# EAGLE design Multiprotocol_STM32_MB_1.1_t (EAGLE 9.5.1)

## Sheet 1 of 4
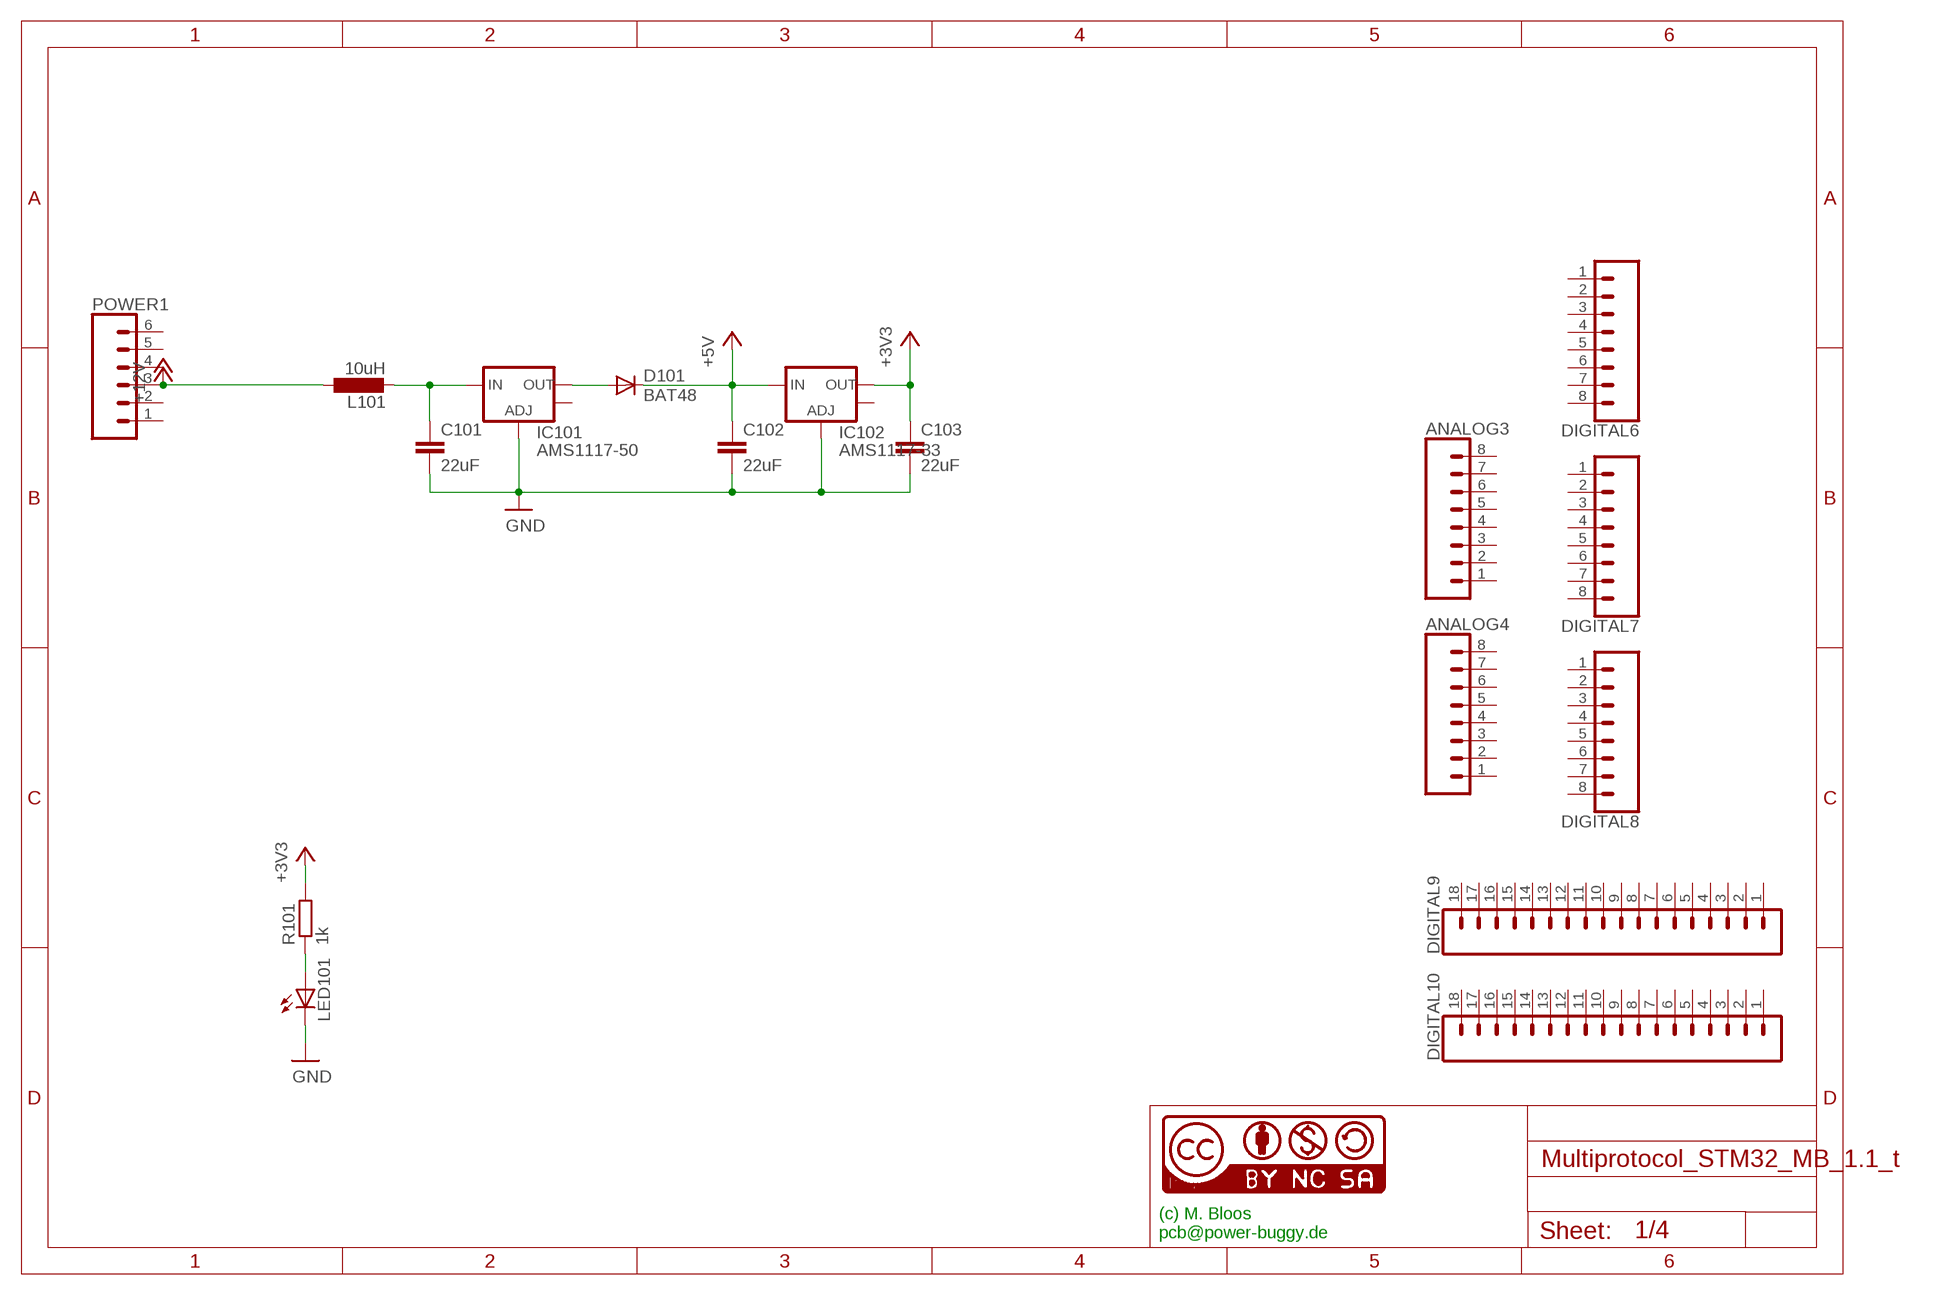
[diagram p0: schematic, sheet 1]

### Parts
ANALOG3  CONN_08NO_SILK_FEMALE_PTH  [1X08_NO_SILK]
ANALOG4  CONN_08NO_SILK_FEMALE_PTH  [1X08_NO_SILK]
C101  22uF  C-EUC1210K  [C1210K]
C102  22uF  C-EUC1210K  [C1210K]
C103  22uF  C-EUC1210K  [C1210K]
D101  BAT48  DIODE-MINIMELF  [MINIMELF]
DIGITAL6  CONN_08NO_SILK_FEMALE_PTH  [1X08_NO_SILK]
DIGITAL7  CONN_08NO_SILK_FEMALE_PTH  [1X08_NO_SILK]
DIGITAL8  CONN_08NO_SILK_FEMALE_PTH  [1X08_NO_SILK]
DIGITAL9  CONN_18  [1X18]
DIGITAL10  CONN_18  [1X18]
IC101  AMS1117-50  V_REG_LM1117SOT223  [SOT223]
IC102  AMS1117-33  V_REG_LM1117SOT223  [SOT223]
L101  10uH  L-EUL1812  [L1812]
LED101  LED3MM  [LED3MM]
NIX101  CC-NC-BCNIX  [CC-NC-B_NIX]
POWER1  CONN_06NO_SILK_FEMALE_PTH  [1X06_NO_SILK]
R101  1k  R-EU_R0805  [R0805]

### Nets
+3V3: C103.1 IC102.2(OUT) R101.2 ; also sheet 2,3,4
+5V: C102.1 D101.C IC102.3(IN) ; also sheet 2
+12V: L101.1 POWER1.3 ; also sheet 3
GND: C101.2 C102.2 C103.2 IC101.1(ADJ) IC102.1(ADJ) LED101.K(C) ; also sheet 2,3,4
N$4: C101.1 IC101.3(IN) L101.2
N$6: LED101.A R101.1
N$19: D101.A IC101.2(OUT)
Unconnected: ANALOG3.1 ANALOG3.2 ANALOG3.3 ANALOG3.4 ANALOG3.5 ANALOG3.6 ANALOG3.7 ANALOG3.8 ANALOG4.1 ANALOG4.2 ANALOG4.3 ANALOG4.4 ANALOG4.5 ANALOG4.6 ANALOG4.7 ANALOG4.8 DIGITAL6.1 DIGITAL6.2 DIGITAL6.3 DIGITAL6.4 DIGITAL6.5 DIGITAL6.6 DIGITAL6.7 DIGITAL6.8 DIGITAL7.1 DIGITAL7.2 DIGITAL7.3 DIGITAL7.4 DIGITAL7.5 DIGITAL7.6 DIGITAL7.7 DIGITAL7.8 DIGITAL8.1 DIGITAL8.2 DIGITAL8.3 DIGITAL8.4 DIGITAL8.5 DIGITAL8.6 DIGITAL8.7 DIGITAL8.8 DIGITAL9.1 DIGITAL9.2 DIGITAL9.3 DIGITAL9.4 DIGITAL9.5 DIGITAL9.6 DIGITAL9.7 DIGITAL9.8 DIGITAL9.9 DIGITAL9.10 DIGITAL9.11 DIGITAL9.12 DIGITAL9.13 DIGITAL9.14 DIGITAL9.15 DIGITAL9.16 DIGITAL9.17 DIGITAL9.18 DIGITAL10.1 DIGITAL10.2 DIGITAL10.3 DIGITAL10.4 DIGITAL10.5 DIGITAL10.6 DIGITAL10.7 DIGITAL10.8 DIGITAL10.9 DIGITAL10.10 DIGITAL10.11 DIGITAL10.12 DIGITAL10.13 DIGITAL10.14 DIGITAL10.15 DIGITAL10.16 DIGITAL10.17 DIGITAL10.18 IC101.4(OUT) IC102.4(OUT) POWER1.1 POWER1.2 POWER1.4 POWER1.5 POWER1.6

### Notes on the sheet
- (c) M. Bloos 
  pcb@power-buggy.de

## Sheet 2 of 4
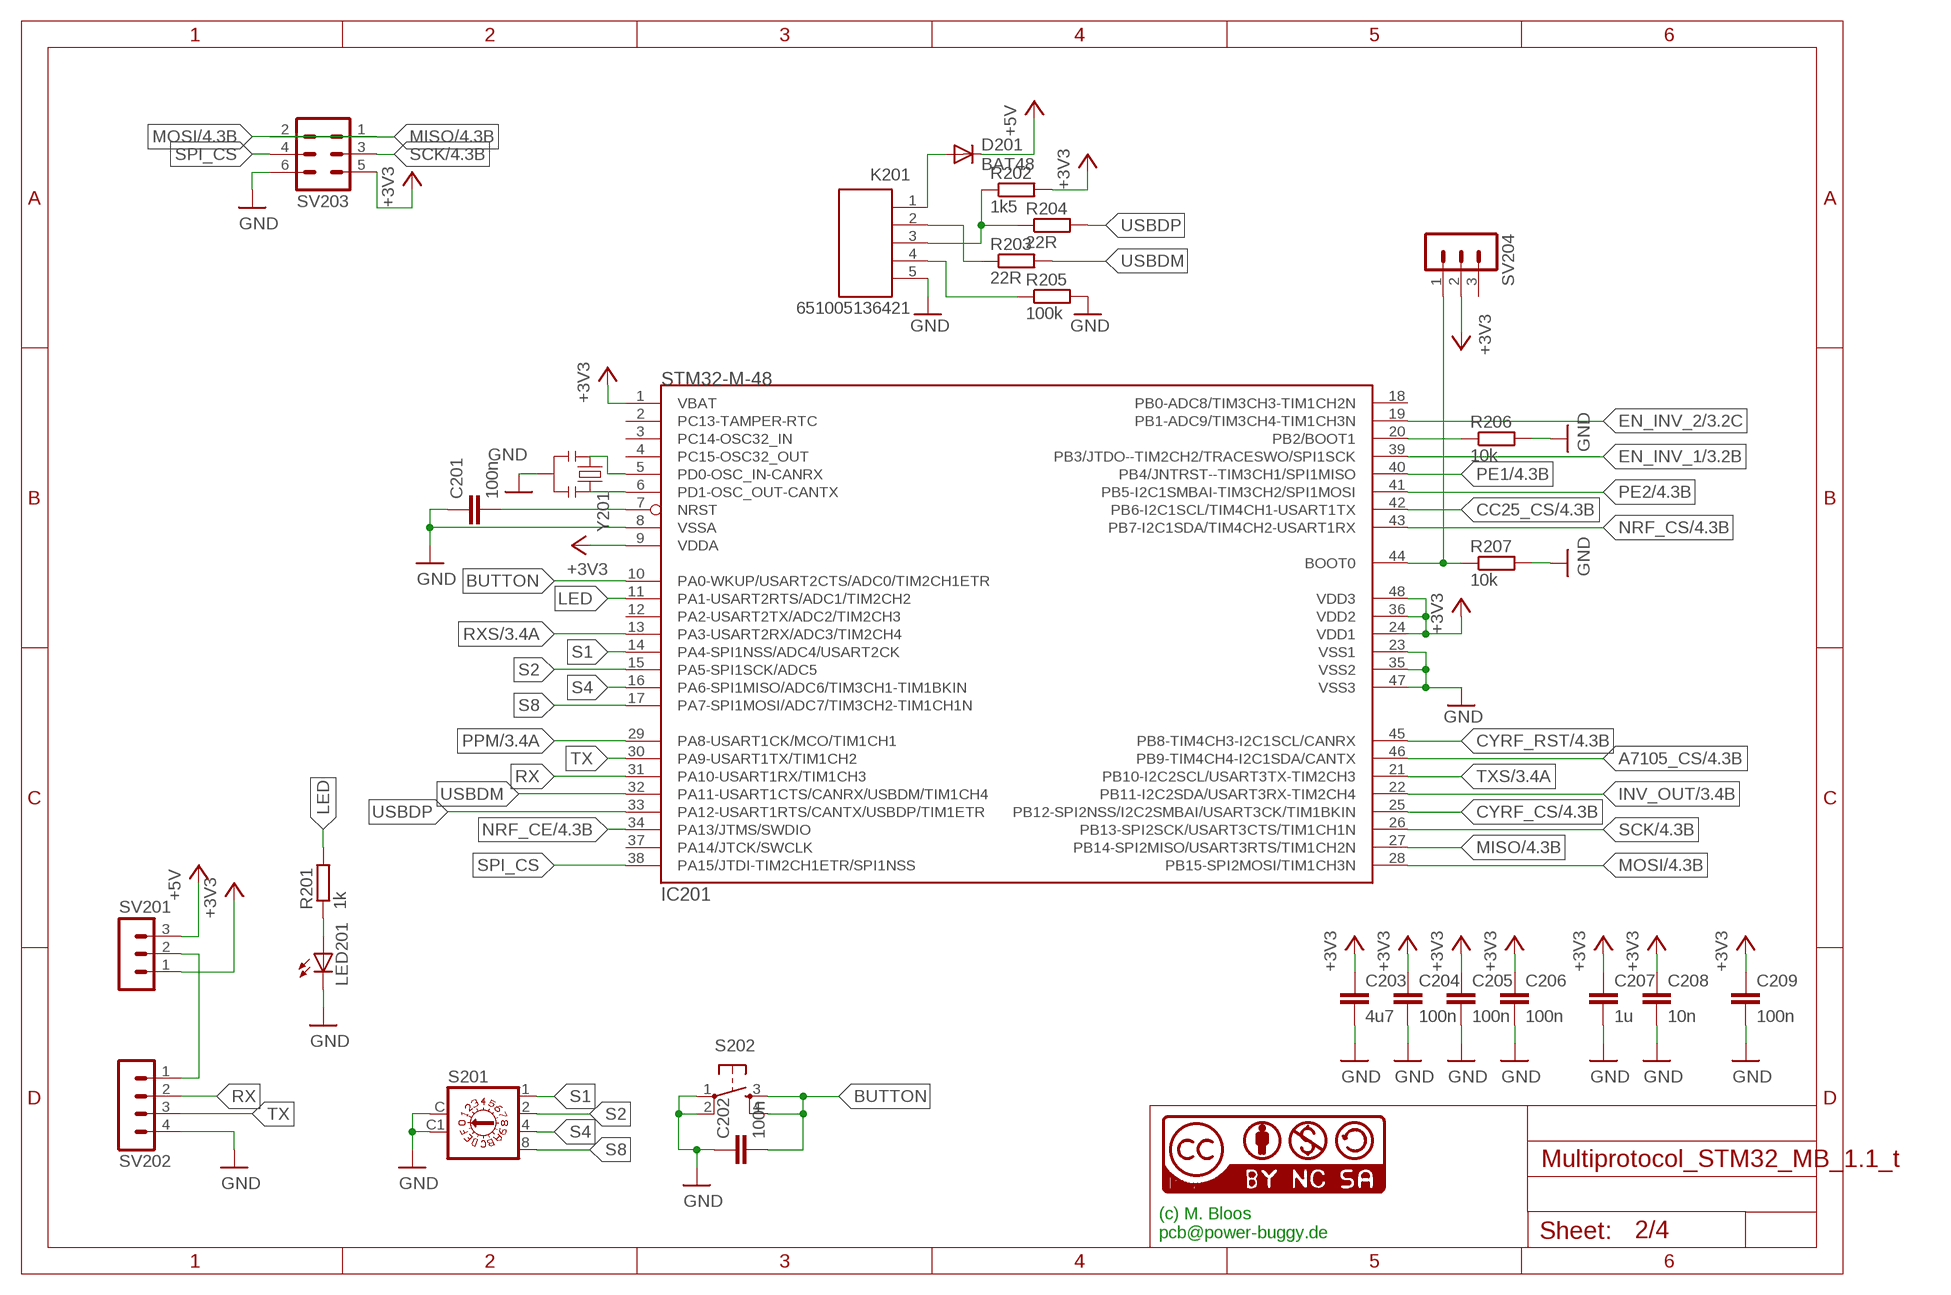
[diagram p1: schematic, sheet 2]

### Parts
C201  100n  C-EUC0805  [C0805]
C202  100n  C-EUC0805  [C0805]
C203  4u7  C-EUC0805  [C0805]
C204  100n  C-EUC0805  [C0805]
C205  100n  C-EUC0805  [C0805]
C206  100n  C-EUC0805  [C0805]
C207  1u  C-EUC0805  [C0805]
C208  10n  C-EUC0805  [C0805]
C209  100n  C-EUC0805  [C0805]
D201  BAT48  DIODE-MINIMELF  [MINIMELF]
IC201  STM32-M-48  [LQFP48]
K201  651005136421  [651005136421]
LED201  LED3MM  [LED3MM]
NIX201  CC-NC-BCNIX  [CC-NC-B_NIX]
R201  1k  R-EU_R0805  [R0805]
R202  1k5  R-EU_R0805  [R0805]
R203  22R  R-EU_R0805  [R0805]
R204  22R  R-EU_R0805  [R0805]
R205  100k  R-EU_R0805  [R0805]
R206  10k  R-EU_R0805  [R0805]
R207  10k  R-EU_R0805  [R0805]
S201  A1353HEX  [A1353HEX]
S202  TAC_SWITCHPTH  [TACTILE-PTH]
SV201  MA03-1  [MA03-1]
SV202  MA04-1  [MA04-1]
SV203  MA03-2  [MA03-2]
SV204  MA03-1  [MA03-1]
Y201  CSTCE8M00G52-R0  RESONATORSMD  [RESONATOR-SMD]

### Nets
+3V3: C203.1 C204.1 C205.1 C206.1 C207.1 C208.1 C209.1 IC201.1(VBAT) IC201.9(VDDA) IC201.24(VDD1) IC201.36(VDD2) IC201.48(VDD3) R202.2 SV201.1 SV203.5 SV204.2 ; also sheet 1,3,4
+5V: D201.C SV201.3 ; also sheet 1
A7105_CS: IC201.46(PB9-TIM4CH4-I2C1SDA/CANTX) ; also sheet 4
BUTTON: C202.2 IC201.10(PA0-WKUP/USART2CTS/ADC0/TIM2CH1ETR) S202.3 S202.4
CC25_CS: IC201.42(PB6-I2C1SCL/TIM4CH1-USART1TX) ; also sheet 4
CYRF_CS: IC201.25(PB12-SPI2NSS/I2C2SMBAI/USART3CK/TIM1BKIN) ; also sheet 4
CYRF_RST: IC201.45(PB8-TIM4CH3-I2C1SCL/CANRX) ; also sheet 4
EN_INV_1: IC201.39(PB3/JTDO--TIM2CH2/TRACESWO/SPI1SCK) ; also sheet 3
EN_INV_2: IC201.19(PB1-ADC9/TIM3CH4-TIM1CH3N) ; also sheet 3
GND: C201.1 C202.1 C203.2 C204.2 C205.2 C206.2 C207.2 C208.2 C209.2 IC201.8(VSSA) IC201.23(VSS1) IC201.35(VSS2) IC201.47(VSS3) K201.5 LED201.K(C) R205.2 R206.2 R207.2 S201.C S201.C1(NC) S202.1 S202.2 SV202.4 SV203.6 Y201.2 ; also sheet 1,3,4
INV_OUT: IC201.22(PB11-I2C2SDA/USART3RX-TIM2CH4) ; also sheet 3
LED: IC201.11(PA1-USART2RTS/ADC1/TIM2CH2) R201.2
MISO: IC201.27(PB14-SPI2MISO/USART3RTS/TIM1CH2N) SV203.2 ; also sheet 4
MOSI: IC201.28(PB15-SPI2MOSI/TIM1CH3N) SV203.1 ; also sheet 4
N$2: IC201.5(PD0-OSC_IN-CANRX) Y201.1
N$3: IC201.6(PD1-OSC_OUT-CANTX) Y201.3
N$7: SV201.2 SV202.1
N$9: K201.4 R205.1
N$11: LED201.A R201.1
N$12: C201.2 IC201.7(NRST)
N$13: K201.3 R202.1 R204.1
N$14: D201.A K201.1
N$17: K201.2 R203.1
N$23: IC201.44(BOOT0) R207.1 SV204.1
N$26: IC201.20(PB2/BOOT1) R206.1
NRF_CE: IC201.34(PA13/JTMS/SWDIO) ; also sheet 4
NRF_CS: IC201.43(PB7-I2C1SDA/TIM4CH2-USART1RX) ; also sheet 4
PE1: IC201.40(PB4/JNTRST--TIM3CH1/SPI1MISO) ; also sheet 4
PE2: IC201.41(PB5-I2C1SMBAI-TIM3CH2/SPI1MOSI) ; also sheet 4
PPM: IC201.29(PA8-USART1CK/MCO/TIM1CH1) ; also sheet 3
RX: IC201.31(PA10-USART1RX/TIM1CH3) SV202.2
RXS: IC201.13(PA3-USART2RX/ADC3/TIM2CH4) ; also sheet 3
S1: IC201.14(PA4-SPI1NSS/ADC4/USART2CK) S201.1
S2: IC201.15(PA5-SPI1SCK/ADC5) S201.2
S4: IC201.16(PA6-SPI1MISO/ADC6/TIM3CH1-TIM1BKIN) S201.4
S8: IC201.17(PA7-SPI1MOSI/ADC7/TIM3CH2-TIM1CH1N) S201.8
SCK: IC201.26(PB13-SPI2SCK/USART3CTS/TIM1CH1N) SV203.3 ; also sheet 4
SPI_CS: IC201.38(PA15/JTDI-TIM2CH1ETR/SPI1NSS) SV203.4
TX: IC201.30(PA9-USART1TX/TIM1CH2) SV202.3
TXS: IC201.21(PB10-I2C2SCL/USART3TX-TIM2CH3) ; also sheet 3
USBDM: IC201.32(PA11-USART1CTS/CANRX/USBDM/TIM1CH4) R203.2
USBDP: IC201.33(PA12-USART1RTS/CANTX/USBDP/TIM1ETR) R204.2
Unconnected: IC201.2(PC13-TAMPER-RTC) IC201.3(PC14-OSC32_IN) IC201.4(PC15-OSC32_OUT) IC201.12(PA2-USART2TX/ADC2/TIM2CH3) IC201.18(PB0-ADC8/TIM3CH3-TIM1CH2N) IC201.37(PA14/JTCK/SWCLK) SV204.3

### Notes on the sheet
- (c) M. Bloos 
  pcb@power-buggy.de

## Sheet 3 of 4
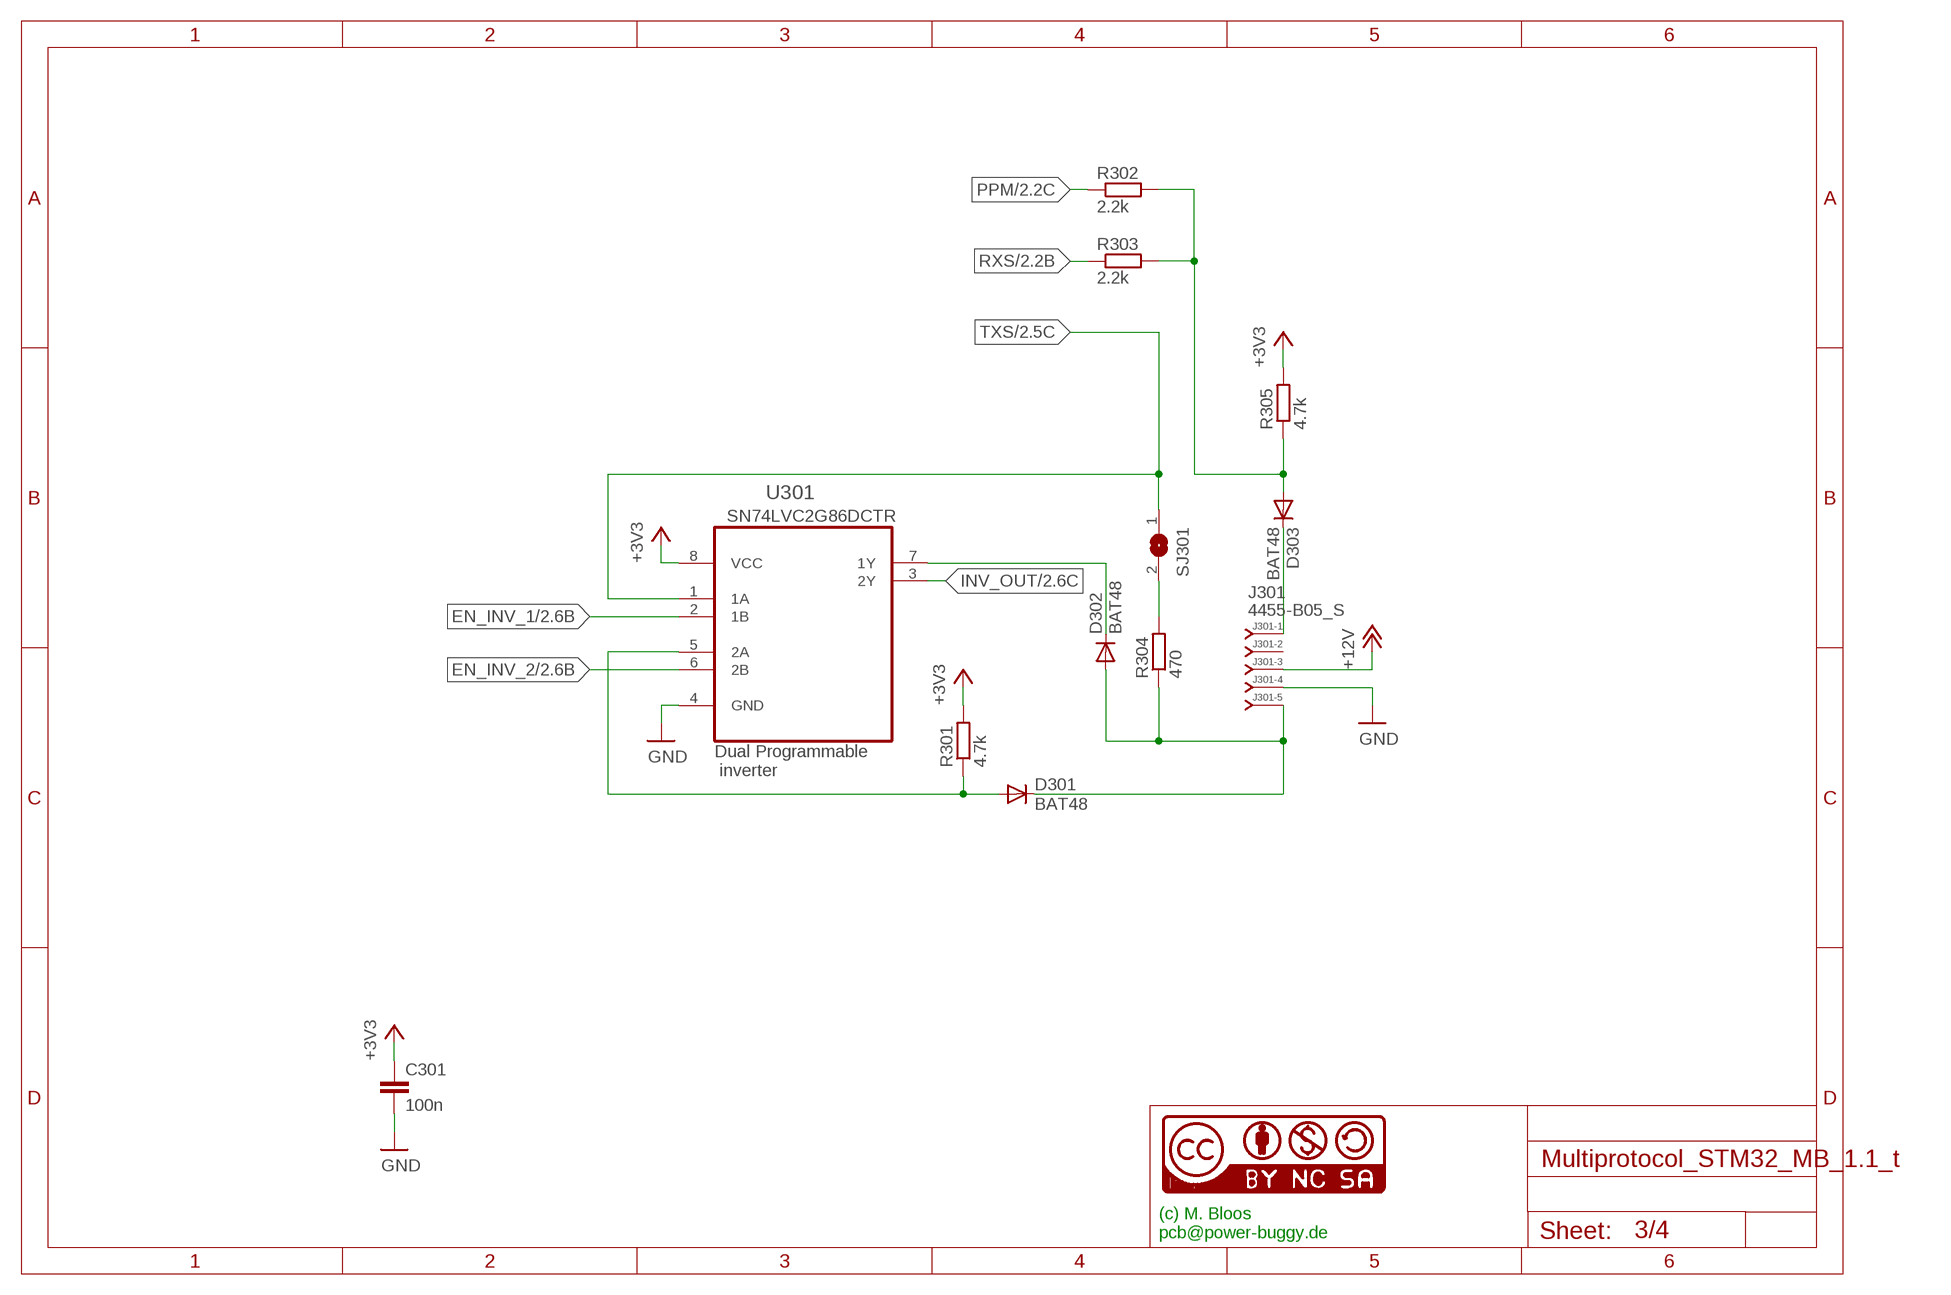
[diagram p2: schematic, sheet 3]

### Parts
C301  100n  C-EUC0805  [C0805]
D301  BAT48  DIODE-MINIMELF  [MINIMELF]
D302  BAT48  DIODE-MINIMELF  [MINIMELF]
D303  BAT48  DIODE-MINIMELF  [MINIMELF]
J301  4455-B05_S  [4455-B05]
NIX301  CC-NC-BCNIX  [CC-NC-B_NIX]
R301  4.7k  R-EU_R0805  [R0805]
R302  2.2k  R-EU_R0805  [R0805]
R303  2.2k  R-EU_R0805  [R0805]
R304  470  R-EU_R0805  [R0805]
R305  4.7k  R-EU_R0805  [R0805]
SJ301  SJ  [SJ]
U301  SN74LVC2G00DCTR  [SOP65P400X130-8N]

### Nets
+3V3: C301.1 R301.2 R305.2 U301.8(VCC) ; also sheet 1,2,4
+12V: J301.3 ; also sheet 1
EN_INV_1: U301.2(1B) ; also sheet 2
EN_INV_2: U301.6(2B) ; also sheet 2
GND: C301.2 J301.4 U301.4(GND) ; also sheet 1,2,4
INV_OUT: U301.3(2Y) ; also sheet 2
N$1: D302.C U301.7(1Y)
N$5: R304.2 SJ301.2
N$8: D301.A R301.1 U301.5(2A)
N$10: D301.C D302.A J301.5 R304.1
N$15: D303.A R302.2 R303.2 R305.1
N$18: D303.C J301.1
PPM: R302.1 ; also sheet 2
RXS: R303.1 ; also sheet 2
TXS: SJ301.1 U301.1(1A) ; also sheet 2
Unconnected: J301.2

### Notes on the sheet
- SN74LVC2G86DCTR
- Dual Programmable
   inverter
- (c) M. Bloos 
  pcb@power-buggy.de

## Sheet 4 of 4
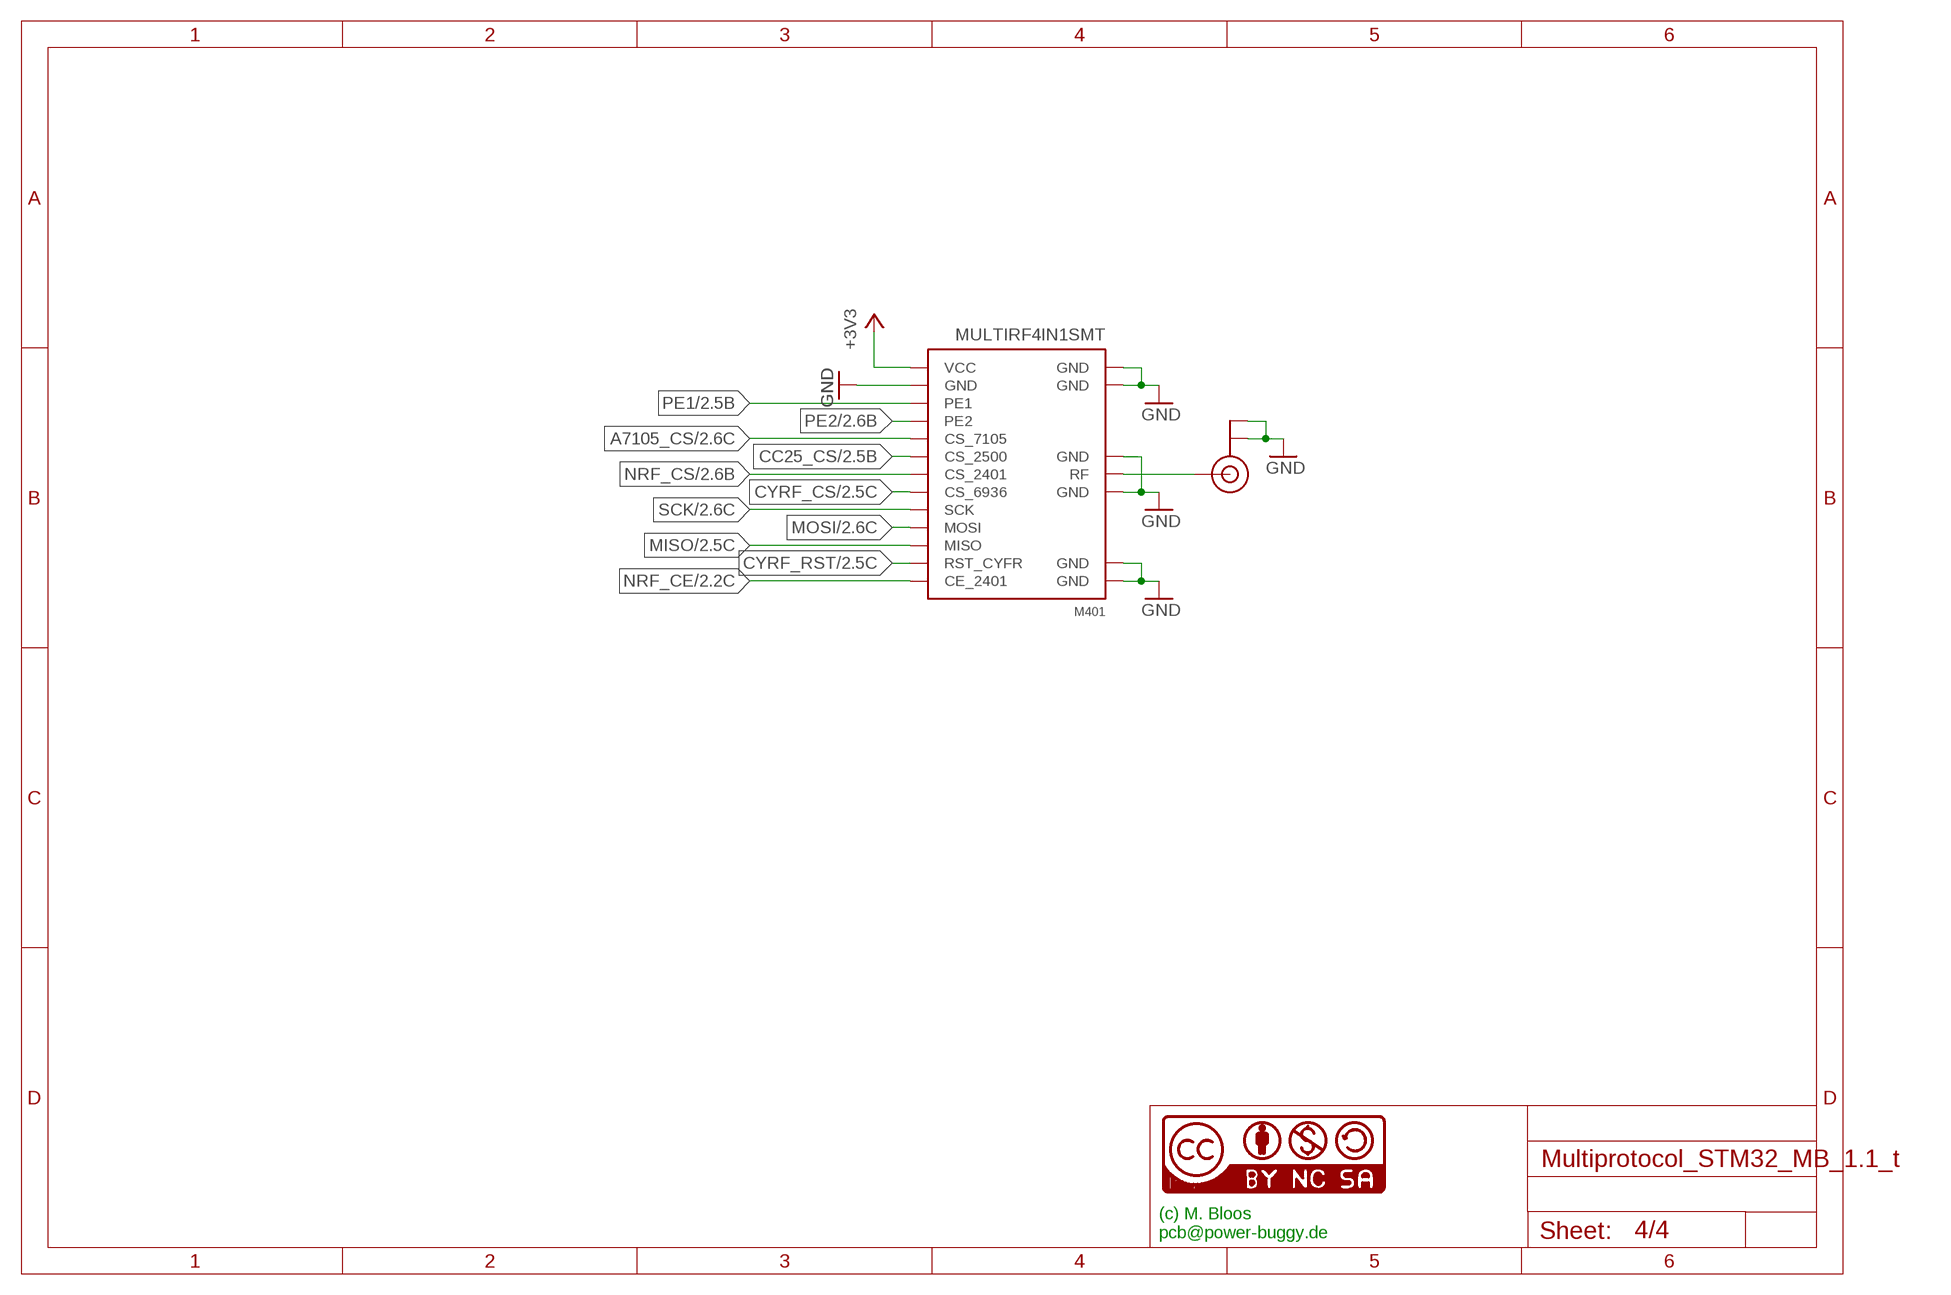
[diagram p3: schematic, sheet 4]

### Parts
CON401  U.FL  [U.FL]
M401  MULTIRF4IN1SMT  [MULTIRF4IN1-SMT]
NIX401  CC-NC-BCNIX  [CC-NC-B_NIX]

### Nets
+3V3: M401.VCC ; also sheet 1,2,3
A7105_CS: M401.CS_7105 ; also sheet 2
CC25_CS: M401.CS_2500 ; also sheet 2
CYRF_CS: M401.CS_6936 ; also sheet 2
CYRF_RST: M401.RST_CYFR ; also sheet 2
GND: CON401.P$1(GND) CON401.P$2(GND) M401.GND M401.GND@1(GND) M401.GND@2(GND) M401.GND@3(GND) M401.GND@4(GND) M401.GND@5(GND) M401.GND@6(GND) ; also sheet 1,2,3
MISO: M401.MISO ; also sheet 2
MOSI: M401.MOSI ; also sheet 2
N$16: CON401.P$3(SIGNAL) M401.RF
NRF_CE: M401.CE_2401 ; also sheet 2
NRF_CS: M401.CS_2401 ; also sheet 2
PE1: M401.PE1 ; also sheet 2
PE2: M401.PE2 ; also sheet 2
SCK: M401.SCK ; also sheet 2

### Notes on the sheet
- (c) M. Bloos 
  pcb@power-buggy.de

## Library data of the parts
ANALOG3 ANALOG4 DIGITAL6-DIGITAL8 = SparkFun-Connectors:CONN_08: Multi connection point. Often used as Generic Header-pin footprint for 0.1 inch spaced/style header connections On any of the 0.1 inch spaced packages, you can populate with these: Break Away Headers - Straight <https://www.sparkfun.com/products/116> (PRT-00116) Break Away Male Headers - Right Angle <https://www.sparkfun.com/products/553> (PRT-00553) Female Headers <https://www.sparkfun.com/products/115> (PRT-00115) Break Away Headers - Machine Pin <https://www.sparkfun.com/products/117> (PRT-00117) Break Away Female Headers - Swiss Machine Pin <https://www.sparkfun.com/products/743> (PRT-00743) Arduino Stackable Header - 8 Pin <https://www.sparkfun.com/products/9279> (PRT-09279) For SCREWTERMINALS and SPRING TERMINALS visit here: Screw Terimnals on SparkFun.com <https://www.sparkfun.com/search/results?term=Screw+Terminals> (5mm/3.5mm/2.54mm spacing) This device is also useful as a general connection point to wire up your design to another part of your project. Our various solder wires solder well into these plated through hole pads. Hook-Up Wire - Assortment (Stranded, 22 AWG) <https://www.sparkfun.com/products/11375> (PRT-11375) Hook-Up Wire - Assortment (Solid Core, 22 AWG) <https://www.sparkfun.com/products/11367> (PRT-11367) View the entire wire category on our website here <https://www.sparkfun.com/categories/141> Special notes: Molex polarized connector foot print use with SKU : PRT-08231 with associated crimp pins and housings. 1MM SMD Version SKU: PRT-10208 NOTES ON THE VARIANTS LOCK and LOCK_LONGPADS... This footprint was designed to help hold the alignment of a through-hole component (i.e. 6-pin header) while soldering it into place. You may notice that each hole has been shifted either up or down by 0.005 of an inch from it's more standard position (which is a perfectly straight line). This slight alteration caused the pins (the squares in the middle) to touch the edges of the holes. Because they are alternating, it causes a "brace" to hold the component in place. 0.005 has proven to be the perfect amount of "off-center" position when using our standard breakaway headers. Although looks a little odd when you look at the bare footprint, once you have a header in there, the alteration is very hard to notice. Also,if you push a header all the way into place, it is covered up entirely on the bottom side.; PROD_ID: CONN-08438
C101-C103 = rcl:C-EU: CAPACITOR, European symbol
C201-C209 C301 = resistor:C-EU: CAPACITOR, European symbol
CON401 = SparkFun:U.FL
D101 D201 D301-D303 = diode:DIODE-: DIODE
DIGITAL9 DIGITAL10 = SparkFun-Connectors:CONN_18: Multi connection point. Often used as Generic Header-pin footprint for 0.1 inch spaced/style header connections On any of the 0.1 inch spaced packages, you can populate with these: Break Away Headers - Straight <https://www.sparkfun.com/products/116> (PRT-00116) Break Away Male Headers - Right Angle <https://www.sparkfun.com/products/553> (PRT-00553) Female Headers <https://www.sparkfun.com/products/115> (PRT-00115) Break Away Headers - Machine Pin <https://www.sparkfun.com/products/117> (PRT-00117) Break Away Female Headers - Swiss Machine Pin <https://www.sparkfun.com/products/743> (PRT-00743) For SCREWTERMINALS and SPRING TERMINALS visit here: Screw Terimnals on SparkFun.com <https://www.sparkfun.com/search/results?term=Screw+Terminals> (5mm/3.5mm/2.54mm spacing) This device is also useful as a general connection point to wire up your design to another part of your project. Our various solder wires solder well into these plated through hole pads. Hook-Up Wire - Assortment (Stranded, 22 AWG) <https://www.sparkfun.com/products/11375> (PRT-11375) Hook-Up Wire - Assortment (Solid Core, 22 AWG) <https://www.sparkfun.com/products/11367> (PRT-11367) View the entire wire category on our website here <https://www.sparkfun.com/categories/141> Special notes: Molex polarized connector foot print use with SKU : PRT-08231 with associated crimp pins and housings. 1MM SMD Version SKU: PRT-10208 NOTES ON THE VARIANTS LOCK and LOCK_LONGPADS... This footprint was designed to help hold the alignment of a through-hole component (i.e. 6-pin header) while soldering it into place. You may notice that each hole has been shifted either up or down by 0.005 of an inch from it's more standard position (which is a perfectly straight line). This slight alteration caused the pins (the squares in the middle) to touch the edges of the holes. Because they are alternating, it causes a "brace" to hold the component in place. 0.005 has proven to be the perfect amount of "off-center" position when using our standard breakaway headers. Although looks a little odd when you look at the bare footprint, once you have a header in there, the alteration is very hard to notice. Also,if you push a header all the way into place, it is covered up entirely on the bottom side.
IC101 IC102 = SparkFun-PowerIC:V_REG_LM1117: Voltage Regulator LM1117 Standard adjustable voltage regulator but in SMD form. Spark Fun Electronics SKU : COM-00595
IC201 = UniversalTx:STM32-M-48: STM32F103 Medium Density 48pins
J301 = con-molex-kk:4455-B05_S: RECEPTACAL
K201 = Wuerth_Elektronik_eiCan_Communication_Connectors_v2.2:651005136421: WR-COM Vertical 5 Contacts Mini USB Type B, 5 pins
L101 = resistor:L-EU: INDUCTOR, European symbol
LED101 LED201 = led:LED: LED OSRAM: - CHIPLED LG R971, LG N971, LY N971, LG Q971, LY Q971, LO R971, LY R971 LH N974, LH R974 LS Q976, LO Q976, LY Q976 LO Q996 - Hyper CHIPLED LW Q18S LB Q993, LB Q99A, LB R99A - SideLED LS A670, LO A670, LY A670, LG A670, LP A670 LB A673, LV A673, LT A673, LW A673 LH A674 LY A675 LS A676, LA A676, LO A676, LY A676, LW A676 LS A679, LY A679, LG A679 - Hyper Micro SIDELED® LS Y876, LA Y876, LO Y876, LY Y876 LT Y87S - SmartLED LW L88C, LW L88S LB L89C, LB L89S, LG L890 LS L89K, LO L89K, LY L89K LS L896, LA L896, LO L896, LY L896 - TOPLED LS T670, LO T670, LY T670, LG T670, LP T670 LSG T670, LSP T670, LSY T670, LOP T670, LYG T670 LG T671, LOG T671, LSG T671 LB T673, LV T673, LT T673, LW T673 LH T674 LS T676, LA T676, LO T676, LY T676, LB T676, LH T676, LSB T676, LW T676 LB T67C, LV T67C, LT T67C, LS T67K, LO T67K, LY T67K, LW E67C LS E67B, LA E67B, LO E67B, LY E67B, LB E67C, LV E67C, LT E67C LW T67C LS T679, LY T679, LG T679 LS T770, LO T770, LY T770, LG T770, LP T770 LB T773, LV T773, LT T773, LW T773 LH T774 LS E675, LA E675, LY E675, LS T675 LS T776, LA T776, LO T776, LY T776, LB T776 LHGB T686 LT T68C, LB T68C - Hyper Mini TOPLED® LB M676 - Mini TOPLED Santana® LG M470 LS M47K, LO M47K, LY M47K Source: http://www.osram.convergy.de LUXEON: - LUMILED® LXK2-PW12-R00, LXK2-PW12-S00, LXK2-PW14-U00, LXK2-PW14-V00 LXK2-PM12-R00, LXK2-PM12-S00, LXK2-PM14-U00 LXK2-PE12-Q00, LXK2-PE12-R00, LXK2-PE12-S00, LXK2-PE14-T00, LXK2-PE14-U00 LXK2-PB12-K00, LXK2-PB12-L00, LXK2-PB12-M00, LXK2-PB14-N00, LXK2-PB14-P00, LXK2-PB14-Q00 LXK2-PR12-L00, LXK2-PR12-M00, LXK2-PR14-Q00, LXK2-PR14-R00 LXK2-PD12-Q00, LXK2-PD12-R00, LXK2-PD12-S00 LXK2-PH12-R00, LXK2-PH12-S00 LXK2-PL12-P00, LXK2-PL12-Q00, LXK2-PL12-R00 Source: www.luxeon.com KINGBRIGHT: KA-3528ASYC Source: www.kingbright.com
M401 = 4in1_BG_V2:MULTIRF4IN1
NIX101 NIX201 NIX301 NIX401 = cc-by-nc-sa:CC-NC-BC: All hardware is licensed under the Creative Commons Attribution-Noncommercial-Share Alike 2.5 Switzerland License. To view a copy of this license, visit http://creativecommons.org/licenses/by-nc-sa/2.5/ch/ or send a letter to Creative Commons, 171 Second Street, Suite 300, San Francisco, California, 94105, USA.
POWER1 = SparkFun-Connectors:CONN_06: Multi connection point. Often used as Generic Header-pin footprint for 0.1 inch spaced/style header connections On any of the 0.1 inch spaced packages, you can populate with these: Break Away Headers - Straight <https://www.sparkfun.com/products/116> (PRT-00116) Break Away Male Headers - Right Angle <https://www.sparkfun.com/products/553> (PRT-00553) Female Headers <https://www.sparkfun.com/products/115> (PRT-00115) Break Away Headers - Machine Pin <https://www.sparkfun.com/products/117> (PRT-00117) Break Away Female Headers - Swiss Machine Pin <https://www.sparkfun.com/products/743> (PRT-00743) Arduino Stackable Header - 6 Pin <https://www.sparkfun.com/products/9280> (PRT-09280) For SCREWTERMINALS and SPRING TERMINALS visit here: Screw Terimnals on SparkFun.com <https://www.sparkfun.com/search/results?term=Screw+Terminals> (5mm/3.5mm/2.54mm spacing) This device is also useful as a general connection point to wire up your design to another part of your project. Our various solder wires solder well into these plated through hole pads. Hook-Up Wire - Assortment (Stranded, 22 AWG) <https://www.sparkfun.com/products/11375> (PRT-11375) Hook-Up Wire - Assortment (Solid Core, 22 AWG) <https://www.sparkfun.com/products/11367> (PRT-11367) View the entire wire category on our website here <https://www.sparkfun.com/categories/141>; PROD_ID: CONN-08437
R101 R201-R207 R301-R305 = resistor:R-EU_: RESISTOR, European symbol
S201 = 00_meine:A1353HEX: DIL/CODE SWITCH; OC_FARNELL: unknown; OC_NEWARK: unknown
S202 = SparkFun-Electromechanical:TAC_SWITCH: Momentary Switch Button commonly used for reset or general input. Spark Fun Electronics SKU : COM-00097 SMT- SWCH-08247
SJ301 = jumper:SJ: SMD solder JUMPER
SV201 SV204 = con-lstb:MA03-1: PIN HEADER; OC_FARNELL: unknown; OC_NEWARK: unknown
SV202 = con-lstb:MA04-1: PIN HEADER; OC_FARNELL: unknown; OC_NEWARK: unknown
SV203 = con-lstb:MA03-2: PIN HEADER; OC_FARNELL: unknown; OC_NEWARK: unknown
U301 = Texas Instruments_By_element14_Batch_1:SN74LVC2G00DCTR: DUAL 2-INPUT POSITIVE-NAND GATE; MPN: SN74LVC2G00DCTR; OC_FARNELL: 1595405; OC_NEWARK: 76C4187; PACKAGE: SSOP-8; SUPPLIER: Texas Instruments
Y201 = SparkFun-FreqCtrl:RESONATOR: Resonator Small SMD resonator. This is the itty bitty 10/20MHz resonators with built in caps. CSTCE10M0G55 and CSTCE20M0V53. Footprint has been reviewed closely but hasn't been tested yet.

## Net classes
0 default: width 0.152 mm, drill 0.33 mm

## Board
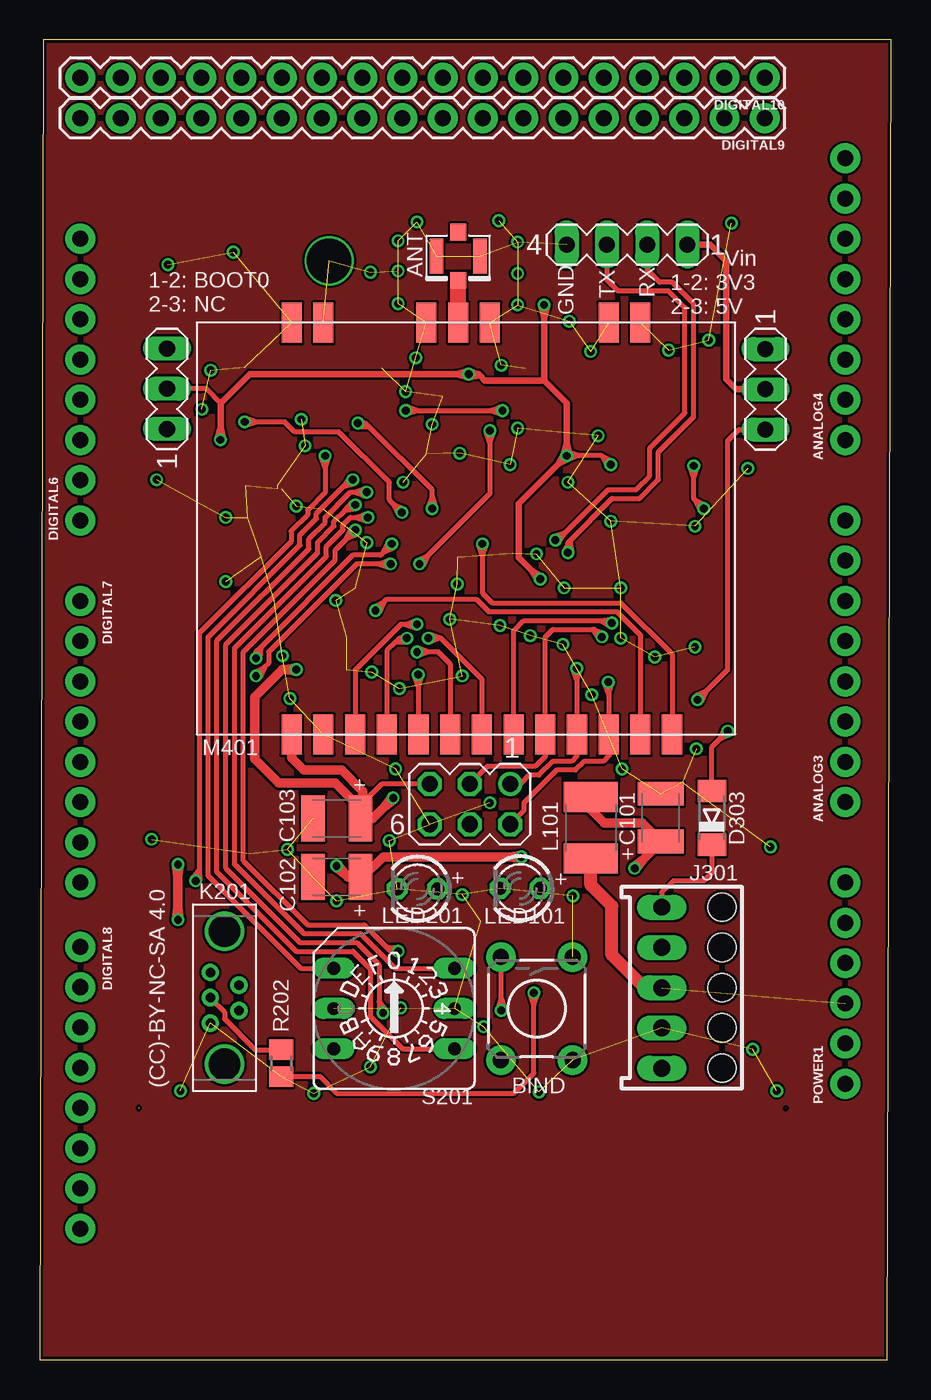
[diagram p4: board, top side]
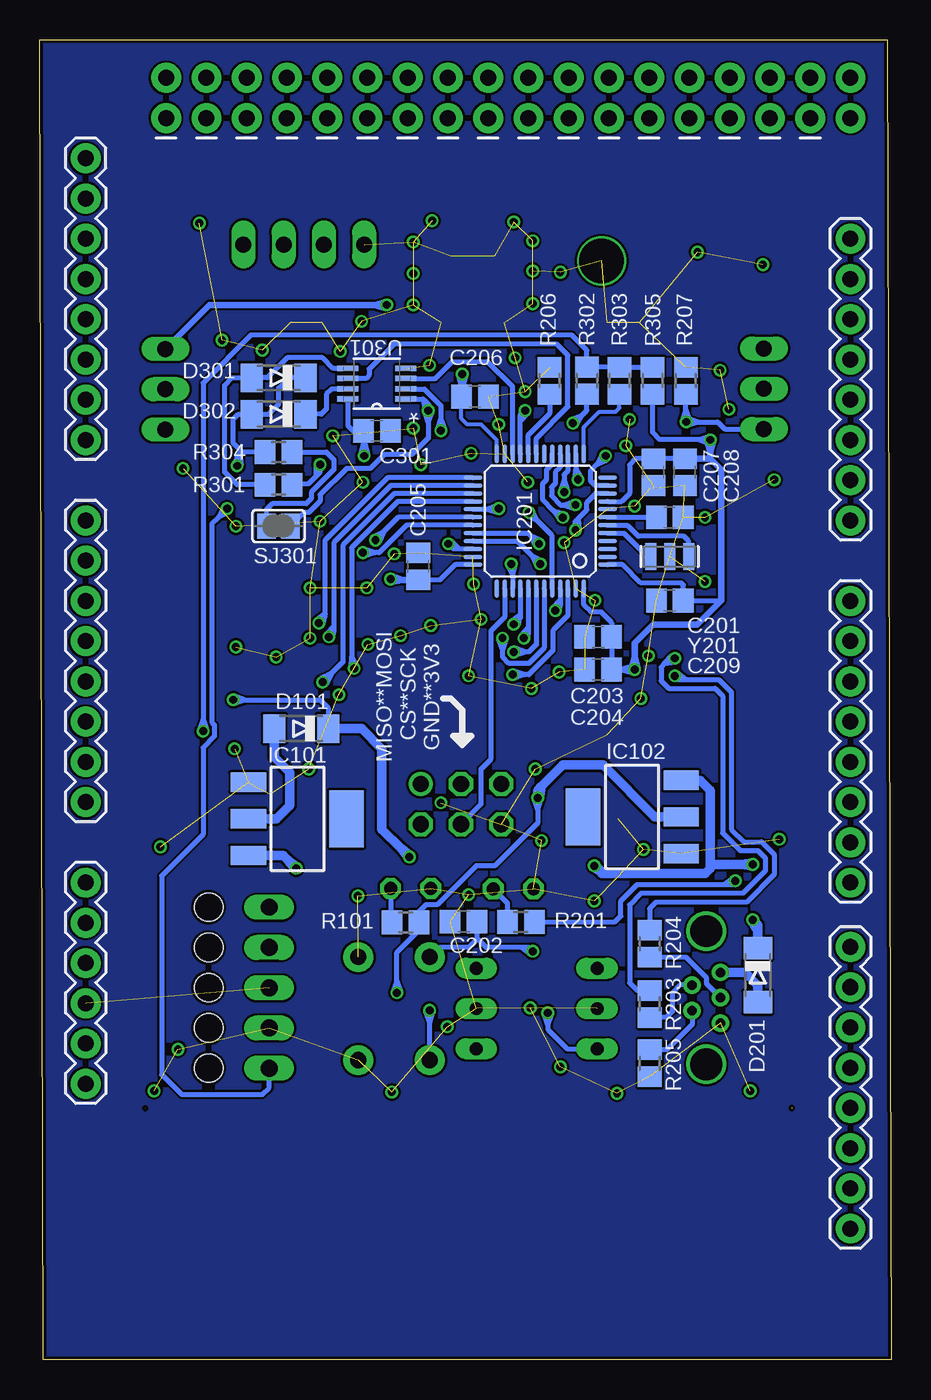
[diagram p5: board, bottom side, seen from below]

Size 53.74 x 83.34 mm. Coordinates in mm from the lower left corner, seen from the top.
Outline: 6.27,15.92 6.27,15.88
Outline: 47.08,15.88 47.08,15.88
Outline: 53.5,0 53.74,83.34 0.24,83.34 0,0 53.5,0
Copper layers (1*16): Top 0.035mm / dielectric 1.5mm / Bottom 0.035mm
Design rules "OHM-HS_Bloos *": minimum track width 0.15mm, minimum drill 0.3mm, track to track 0.15mm, track to pad 0.15mm, pad to pad 0.15mm, via to via 0.15mm, smd to smd 0mil, copper to edge 0.2mm, drill to drill 0.2mm, minimum pad ring 0.25mm, minimum via ring 0.15mm, stop-mask expansion 0.1mm, vias tented up to drill 0.5mm, thermal gap 0.15mm

### Footprints (pad centres in the part's own frame; a part is rotated, then mirrored left to right if it is on the bottom)
1X08_NO_SILK = drill 1.016 pad 1.88: 1 0,0; 2 2.54,0; 3 5.08,0; 4 7.62,0; 5 10.16,0; 6 12.7,0; 7 15.24,0; 8 17.78,0
C1210K = smd 1.5 x 2.9: 1 -1.5,0; 2 1.5,0
C0805 = smd 1.3 x 1.5: 1 -0.85,0; 2 0.85,0
U.FL = smd 2.2 x 0.85: P$1 0,1.375; P$2 0,-1.375 | smd 1.05 x 1: P$3 1.525,0; P$4 -1.525,0
MINIMELF = smd 1.4 x 1.8: A 1.7,0; C -1.7,0
1X18 = drill 1.016 pad 1.88: 1 0,0; 2 2.54,0; 3 5.08,0; 4 7.62,0; 5 10.16,0; 6 12.7,0; 7 15.24,0; 8 17.78,0; 9 20.32,0; 10 22.86,0; 11 25.4,0; 12 27.94,0; 13 30.48,0; 14 33.02,0; 15 35.56,0; 16 38.1,0; 17 40.64,0; 18 43.18,0
SOT223 = smd 1.219 x 2.235: 1 -2.311,-3.099; 2 0,-3.099; 3 2.311,-3.099 | smd 3.6 x 2.2: 4 0,3.099
LQFP48 = smd 0.3 x 1.2: 1 -2.75,-4.25; 2 -2.25,-4.25; 3 -1.75,-4.25; 4 -1.25,-4.25; 5 -0.75,-4.25; 6 -0.25,-4.25; 7 0.25,-4.25; 8 0.75,-4.25; 9 1.25,-4.25; 10 1.75,-4.25; 11 2.25,-4.25; 12 2.75,-4.25; 25 2.75,4.25; 26 2.25,4.25; 27 1.75,4.25; 28 1.25,4.25; 29 0.75,4.25; 30 0.25,4.25; 31 -0.25,4.25; 32 -0.75,4.25; 33 -1.25,4.25; 34 -1.75,4.25; 35 -2.25,4.25; 36 -2.75,4.25 | smd 1.2 x 0.3: 13 4.25,-2.75; 14 4.25,-2.25; 15 4.25,-1.75; 16 4.25,-1.25; 17 4.25,-0.75; 18 4.25,-0.25; 19 4.25,0.25; 20 4.25,0.75; 21 4.25,1.25; 22 4.25,1.75; 23 4.25,2.25; 24 4.25,2.75; 37 -4.25,2.75; 38 -4.25,2.25; 39 -4.25,1.75; 40 -4.25,1.25; 41 -4.25,0.75; 42 -4.25,0.25; 43 -4.25,-0.25; 44 -4.25,-0.75; 45 -4.25,-1.25; 46 -4.25,-1.75; 47 -4.25,-2.25; 48 -4.25,-2.75
4455-B05 = drill 1.067 long: 1 -5.08,0; 2 -2.54,0; 3 0,0; 4 2.54,0; 5 5.08,0 | hole 1.778: -5.08,3.81; -2.54,3.81; 0,3.81; 2.54,3.81; 5.08,3.81
651005136421 = drill 0.6: 1 0.9,-1.6; 2 -0.9,-0.8; 3 0.9,0; 4 -0.9,0.8; 5 0.9,1.6 | drill 2: Z1 0,4.2; Z2 0,-4.2
L1812 = smd 1.9 x 3.4: 1 -1.95,0; 2 1.95,0
LED3MM = drill 0.813 octagon: A -1.27,0; K 1.27,0
MULTIRF4IN1-SMT = smd 2.54 x 1.27: CE_2401 13,13; CS_2401 13,1; CS_2500 13,-1; CS_6936 13,3; CS_7105 13,-3; GND 13,-9; GND@1 -13,11; GND@2 -13,9; GND@3 -13,1.5; GND@4 -13,-2.5; GND@5 -13,-9; GND@6 -13,-11; MISO 13,9; MOSI 13,7; PE1 13,-7; PE2 13,-5; RF -13,-0.5; RST_CYFR 13,11; SCK 13,5; VCC 13,-11
1X06_NO_SILK = drill 1.016 pad 1.88: 1 0,0; 2 2.54,0; 3 5.08,0; 4 7.62,0; 5 10.16,0; 6 12.7,0
R0805 = smd 1.3 x 1.5: 1 -0.85,0; 2 0.85,0
A1353HEX = drill 0.813 long: 1 3.81,-2.54; 2 -3.81,2.54; 4 3.81,2.54; 8 -3.81,-2.54; C 3.81,0; C1 -3.81,0
TACTILE-PTH = drill 1.016 pad 1.88: 1 -3.251,2.261; 2 3.251,2.261; 3 -3.251,-2.261; 4 3.251,-2.261
SJ = smd 1.168 x 1.6: 1 -0.762,0; 2 0.762,0
MA03-1 = drill 1.016 long: 1 -2.54,0; 2 0,0; 3 2.54,0
MA04-1 = drill 1.016 long: 1 -3.81,0; 2 -1.27,0; 3 1.27,0; 4 3.81,0
MA03-2 = drill 1.016: 1 -2.54,-1.27 | drill 1.016 octagon: 2 -2.54,1.27; 3 0,-1.27; 4 0,1.27; 5 2.54,-1.27; 6 2.54,1.27
SOP65P400X130-8N = smd 1.321 x 0.356: 1 -1.829,0.965; 2 -1.829,0.33; 3 -1.829,-0.33; 4 -1.829,-0.965; 5 1.829,-0.965; 6 1.829,-0.33; 7 1.829,0.33; 8 1.829,0.965
RESONATOR-SMD = smd 0.7 x 1.7: 1 -1.2,0; 2 0,0; 3 1.2,0

### Placement (x,y rotation side)
ANALOG3  50.83,35.21 90 top
ANALOG4  50.83,58.07 90 top
C101  39.2,34.23 90 top
C102  18.75,30.48 180 top
C103  18.75,34.18 180 top
C201  13.97,53.18 180 bottom
C202  26.98,27.67 0 bottom
C203  18.49,45.64 180 bottom
C204  18.49,43.58 180 bottom
C205  29.84,50.09 90 bottom
C206  26.27,60.8 0 bottom
C207  15,56.04 270 bottom
C208  13.02,56.04 270 bottom
C209  13.97,47.94 180 bottom
C301  32.45,58.65 0 bottom
CON401  26.41,69.67 270 top
D101  37.23,39.85 180 bottom
D201  8.41,24.29 270 bottom
D301  38.66,61.99 180 bottom
D302  38.66,59.69 180 bottom
D303  42.41,34.22 90 top
DIGITAL6  2.57,52.99 90 top
DIGITAL7  2.57,47.91 270 top
DIGITAL8  2.57,26.07 270 top
DIGITAL9  45.75,78.39 180 top
DIGITAL10  45.75,80.93 180 top
IC101  37.47,34.15 270 bottom
IC102  16.35,34.27 90 bottom
IC201  22.15,52.94 90 bottom
J301  39.26,23.5 270 top
K201  11.67,22.86 180 top
L101  34.79,33.59 90 top
LED101  30.32,29.77 180 top
LED201  23.84,29.74 180 top
M401  26.91,52.48 270 top
NIX101  6.91,16.51 0 top
NIX201  6.98,16.51 0 top
NIX301  6.91,16.59 0 top
NIX401  6.98,16.59 0 top
POWER1  50.83,17.43 90 top
R101  30.64,27.62 0 bottom
R201  23.37,27.65 0 bottom
R202  15.24,18.73 270 top
R203  15.24,22.46 90 bottom
R204  15.24,26.27 90 bottom
R205  15.24,18.73 270 bottom
R206  21.56,61.8 90 bottom
R207  12.96,61.81 90 bottom
R301  38.66,55.24 0 bottom
R302  19.2,61.82 90 bottom
R303  17.14,61.8 90 bottom
R304  38.66,57.31 0 bottom
R305  15.06,61.81 270 bottom
S201  22.37,22.17 180 top
S202  31.37,22.17 270 top
SJ301  38.67,52.64 180 bottom
SV201  45.8,61.28 270 top
SV202  37.07,70.41 180 top
SV203  27.15,35.08 180 top
SV204  8.04,61.3 90 top
U301  32.46,61.62 180 bottom
Y201  13.98,50.7 0 bottom

### Tracks (layer width: path | path; a pad name or v marks a point on that pad's centre or on a via)
+3V3  (via drill 0.5)
  Top 0.305: 11.43,60.4 10.53,61.3 SV204.2 | v36.04,56.52 35.51,57.05 | 35.51,57.05 35.48,57.07 34.01,57.07 | 34.01,57.07 v33.26,57.07 | R202.2 17.68,17.88 18.73,16.83 29.92,16.83 31.19,18.1 31.19,22.43 | 31.19,22.43 v31.19,23.18 | SV203.5 21.59,36.35 20.4,35.16 | 34.01,57.07 33.34,57.3 v33.26,57.07 | 34.01,57.07 33.34,56.84 v33.26,57.07 | 35.51,57.05 35.81,56.41 v36.04,56.52 | 35.51,57.05 36.14,56.74 v36.04,56.52 | 31.19,22.43 31.43,23.1 v31.19,23.18 | 31.19,22.43 30.96,23.1 v31.19,23.18
  Top 0.406: 11.43,58.83 11.43,58.1 v11.41,58.08 | 11.43,58.83 11.43,60.4 13.26,62.23 26.32,62.23 | 26.32,62.23 v27.07,62.23 | v27.07,62.23 27.7,62.23 27.81,62.12 | 27.81,62.12 28.1,61.83 31.83,61.83 | 31.83,61.83 33.26,60.4 33.26,57.82 | 33.26,57.82 v33.26,57.07 | v33.26,57.07 32.73,56.54 | 32.73,56.54 30.24,54.05 30.24,50.64 31.06,49.82 | 31.06,49.82 v31.59,49.29 | 31.83,61.83 31.83,65.85 | 31.83,65.85 v31.83,66.6 | 11.43,58.83 11.22,58.14 v11.41,58.08 | 11.43,58.83 11.6,58.13 v11.41,58.08 | 26.32,62.23 27.02,62.04 v27.07,62.23 | 26.32,62.23 27.02,62.42 v27.07,62.23 | 27.81,62.12 27.15,62.41 v27.07,62.23 | 27.81,62.12 27.09,62.03 v27.07,62.23 | 33.26,57.82 33.07,57.12 v33.26,57.07 | 33.26,57.82 33.45,57.12 v33.26,57.07 | 32.73,56.54 33.36,56.9 v33.26,57.07 | 32.73,56.54 33.09,57.17 v33.26,57.07 | 31.06,49.82 31.42,49.19 v31.59,49.29 | 31.06,49.82 31.69,49.46 v31.59,49.29 | 31.83,65.85 32.02,66.54 v31.83,66.6 | 31.83,65.85 31.64,66.54 v31.83,66.6
  Top 0.61: v16.19,43.58 15.44,43.58 | 15.44,43.58 15.32,43.58 13.57,41.83 13.57,37.94 15.08,36.43 18.65,36.43 20.25,34.84 C103.1 | v22.3,35.48 21.77,34.95 | 21.77,34.95 21.01,34.18 C103.1 | M401.VCC 15.91,37.99 16.67,37.23 19.05,37.23 20.4,35.88 20.4,35.16 20.4,34.34 C103.1 | 21.77,34.95 22.36,35.41 v22.3,35.48 | 21.77,34.95 22.23,35.54 v22.3,35.48 | 15.44,43.58 16.18,43.48 v16.19,43.58 | 15.44,43.58 16.18,43.67 v16.19,43.58
  Bottom 0.254: IC201.24 24.9,58.07 25.88,59.05 26.75,59.05 27.12,59.43 C206.1
  Bottom 0.305: C208.1 C207.1 16.14,56.89 16.51,56.52 16.51,54.69 17.01,54.19 IC201.9 | C204.1 C203.1 17.64,46.54 18.34,47.23 18.97,47.23 19.4,47.65 IC201.48 | IC201.1 16.93,50.19 15.8,49.05 13.26,49.05 13.12,48.92 C209.1 10.72,47.94 | IC201.36 27.51,50.19 28.47,49.24 C205.1 | U301.8 34.29,58.97 33.97,58.66 33.32,58.66 C301.1 | v11.41,58.08 11.43,58.1 12.16,58.1 | 12.16,58.1 14.6,58.1 15.06,58.55 R305.2 | R301.2 37.73,55.32 36.75,55.32 36.27,55.8 | 36.27,55.8 36.04,56.04 v36.04,56.52 | v31.19,23.18 31.19,23.93 | 31.19,23.93 31.19,25.72 29.84,27.07 29.84,27.57 R101.2 29.79,28.31 29.37,28.73 28.65,28.73 26.19,31.19 25,31.19 22.3,33.89 22.3,34.73 | v22.3,35.48 22.3,34.73 | 12.16,58.1 11.48,58.32 v11.41,58.08 | 12.16,58.1 11.5,57.85 v11.41,58.08 | 22.3,34.73 22.54,35.4 v22.3,35.48 | 22.3,34.73 22.07,35.4 v22.3,35.48 | 36.27,55.8 36.28,56.51 v36.04,56.52 | 36.27,55.8 35.84,56.36 v36.04,56.52 | 31.19,23.93 30.96,23.26 v31.19,23.18 | 31.19,23.93 31.43,23.26 v31.19,23.18
  Bottom 0.406: C208.1 11.41,56.89 | 11.41,56.89 10.72,56.2 10.72,47.94 12.22,46.43 15,46.43 16.19,45.24 16.19,44.33 | 11.41,56.89 11.41,57.33 | 11.41,57.33 v11.41,58.08 | v27.07,62.23 27.07,61.48 | 27.07,61.48 27.07,60.86 C206.1 | v33.26,57.07 33.26,57.82 | 33.26,57.82 33.26,58.6 C301.1 | v31.59,49.29 31.53,49.24 30.84,49.24 | 30.84,49.24 C205.1 | v31.83,66.6 32.58,66.6 | 32.58,66.6 43.02,66.6 SV201.1 | v16.19,43.58 16.19,44.33 | C204.1 16.94,43.58 | 16.94,43.58 v16.19,43.58 | 11.41,57.33 11.6,58.03 v11.41,58.08 | 11.41,57.33 11.22,58.03 v11.41,58.08 | 27.07,61.48 27.26,62.18 v27.07,62.23 | 27.07,61.48 26.88,62.18 v27.07,62.23 | 33.26,57.82 33.07,57.12 v33.26,57.07 | 33.26,57.82 33.45,57.12 v33.26,57.07 | 30.84,49.24 31.55,49.1 v31.59,49.29 | 30.84,49.24 31.53,49.48 v31.59,49.29 | 32.58,66.6 31.88,66.79 v31.83,66.6 | 32.58,66.6 31.88,66.41 v31.83,66.6 | 16.19,44.33 16,43.63 v16.19,43.58 | 16.19,44.33 16.38,43.63 v16.19,43.58 | 16.94,43.58 16.24,43.77 v16.19,43.58 | 16.94,43.58 16.24,43.39 v16.19,43.58
  Bottom 0.61: IC102.2 14.91,34.27 18.18,37.54 20.72,37.54 22.07,36.19 | 22.07,36.19 22.3,35.96 v22.3,35.48 | 22.07,36.19 22.21,35.46 v22.3,35.48 | 22.07,36.19 22.39,35.52 v22.3,35.48
+5V  (via drill 0.5)
  Top 0.305: v41.51,41.67 42.04,42.2 | 42.04,42.2 43.42,43.58 43.42,58.02 44.13,58.74 SV201.3 | 42.04,42.2 41.41,41.89 v41.51,41.67 | 42.04,42.2 41.74,41.56 v41.51,41.67
  Top 0.61: 29.65,31.75 21.67,31.75 20.4,30.48 C102.1 19.45,30.48 19.26,30.66 | 29.65,31.75 v30.4,31.75 | v8.73,27.78 8.73,28.53 | 8.73,28.53 8.73,30.52 | 8.73,30.52 v8.73,31.27 | v18.73,31.19 19.26,30.66 | 29.65,31.75 30.39,31.66 v30.4,31.75 | 29.65,31.75 30.39,31.84 v30.4,31.75 | 19.26,30.66 18.81,31.25 v18.73,31.19 | 19.26,30.66 18.67,31.12 v18.73,31.19 | 8.73,28.53 8.64,27.79 v8.73,27.78 | 8.73,28.53 8.83,27.79 v8.73,27.78 | 8.73,30.52 8.83,31.26 v8.73,31.27 | 8.73,30.52 8.64,31.26 v8.73,31.27
  Bottom 0.305: v41.51,41.67 40.76,41.67 | 40.76,41.67 36.04,41.67 35.53,41.16 D101.C | 40.76,41.67 41.43,41.44 v41.51,41.67 | 40.76,41.67 41.43,41.91 v41.51,41.67
  Bottom 0.61: IC102.3 12.06,36.59 11.43,35.96 11.43,31.43 | 11.43,31.43 11.43,31.04 11.75,30.72 18.15,30.72 | 18.15,30.72 18.26,30.72 v18.73,31.19 | D201.C 8.41,27.1 | 8.41,27.1 8.41,27.46 v8.73,27.78 | v8.73,31.27 9.48,31.27 | 9.48,31.27 11.27,31.27 11.43,31.43 | v30.4,31.75 30.93,32.28 | 30.93,32.28 32.15,33.5 32.15,38.58 33.42,39.85 D101.C | 30.93,32.28 30.34,31.83 v30.4,31.75 | 30.93,32.28 30.48,31.69 v30.4,31.75 | 18.15,30.72 18.78,31.11 v18.73,31.19 | 18.15,30.72 18.66,31.26 v18.73,31.19 | 8.41,27.1 8.81,27.73 v8.73,27.78 | 8.41,27.1 8.64,27.81 v8.73,27.78 | 9.48,31.27 8.74,31.37 v8.73,31.27 | 9.48,31.27 8.74,31.18 v8.73,31.27
+12V  (1 unrouted)
  Top 0.813: J301.3 38.18,23.5 36.12,25.56 36.12,28.65 34.79,29.98 L101.1
A7105_CS  (via drill 0.5)
  Top 0.305: 23.91,42.51 23.91,43.24 v23.89,43.26 | 23.91,42.51 M401.CS_7105 | 23.91,42.51 24.13,43.18 v23.89,43.26 | 23.91,42.51 23.66,43.17 v23.89,43.26
  Bottom 0.305: IC201.46 20.4,46.99 21.35,46.04 21.35,44.77 22.86,43.26 23.14,43.26 | 23.14,43.26 v23.89,43.26 | 23.14,43.26 23.81,43.03 v23.89,43.26 | 23.14,43.26 23.81,43.49 v23.89,43.26
BUTTON  (via drill 0.5)
  Top 0.305: 19.39,51.86 18.65,51.12 18.65,50.48 12.86,44.69 12.86,31.51 16.91,27.46 20.48,27.46 21.91,26.03 | 19.39,51.86 v19.92,52.39 | 21.91,26.03 22.15,25.8 v22.62,25.8 | v29.13,22.07 29.13,22.82 | 29.13,22.82 29.13,25.41 S202.3 | 19.39,51.86 20.03,52.16 v19.92,52.39 | 19.39,51.86 19.7,52.49 v19.92,52.39 | 21.91,26.03 22.47,25.6 v22.62,25.8 | 21.91,26.03 22.62,26.04 v22.62,25.8 | 29.13,22.82 28.9,22.15 v29.13,22.07 | 29.13,22.82 29.36,22.15 v29.13,22.07
  Bottom 0.305: IC201.10 18.65,54.69 19.21,54.13 19.21,53.66 19.75,53.12 | v19.92,52.39 19.92,52.94 19.75,53.12 | v22.62,25.8 22.86,26.03 23.33,26.03 | 23.33,26.03 25.56,26.03 26.13,26.61 | 26.13,26.61 C202.2 | 26.13,26.61 26.13,26.57 26.67,26.03 28.5,26.03 S202.3 | S202.4 29.11,21.32 | 29.11,21.32 29.11,22.05 v29.13,22.07 | 19.75,53.12 19.68,52.41 v19.92,52.39 | 19.75,53.12 20.13,52.52 v19.92,52.39 | 23.33,26.03 22.63,26.04 v22.62,25.8 | 23.33,26.03 22.77,25.6 v22.62,25.8 | 29.11,21.32 29.36,21.98 v29.13,22.07 | 29.11,21.32 28.89,21.99 v29.13,22.07
CC25_CS  (via drill 0.5)
  Top 0.305: M401.CS_2500 25.91,43.94 25.16,44.69 24.56,44.69 | 24.56,44.69 v23.81,44.69 | 24.56,44.69 23.89,44.92 v23.81,44.69 | 24.56,44.69 23.89,44.45 v23.81,44.69
  Bottom 0.305: IC201.42 22.4,45.15 22.86,44.69 23.06,44.69 | 23.06,44.69 v23.81,44.69 | 23.06,44.69 23.73,44.45 v23.81,44.69 | 23.06,44.69 23.73,44.92 v23.81,44.69
CYRF_CS  (via drill 0.5)
  Top 0.305: 35.38,46.67 30.56,46.67 29.91,46.02 M401.CS_6936 | 35.38,46.67 35.96,46.67 v36.12,46.51 | 35.38,46.67 35.99,46.3 v36.12,46.51 | 35.38,46.67 36.09,46.76 v36.12,46.51
  Bottom 0.305: IC201.25 31.78,55.69 35.72,51.75 35.72,47.15 | v36.12,46.51 35.72,46.91 35.72,47.15 | 35.72,47.15 35.87,46.46 v36.12,46.51 | 35.72,47.15 36.27,46.71 v36.12,46.51
CYRF_RST  (via drill 0.5)
  Top 0.305: v21.19,47.31 21.72,47.84 | 21.72,47.84 21.91,48.02 27.54,48.02 28.34,47.23 36.43,47.23 37.91,45.75 M401.RST_CYFR | 21.72,47.84 21.09,47.53 v21.19,47.31 | 21.72,47.84 21.42,47.2 v21.19,47.31
  Bottom 0.305: IC201.45 20.9,48 | 20.9,48 20.9,47.6 v21.19,47.31 | 20.9,48 20.95,47.29 v21.19,47.31 | 20.9,48 21.38,47.48 v21.19,47.31
EN_INV_1  (via drill 0.5)
  Top 0.305: v28.42,58.66 28.42,57.91 | 28.42,57.91 28.42,54.69 24.5,50.77 | 24.5,50.77 v23.97,50.24 | 28.42,57.91 28.65,58.58 v28.42,58.66 | 28.42,57.91 28.18,58.58 v28.42,58.66 | 24.5,50.77 23.86,50.47 v23.97,50.24 | 24.5,50.77 24.19,50.14 v23.97,50.24
  Bottom 0.305: U301.2 29.47,61.29 28.42,60.25 28.42,59.41 | 28.42,59.41 v28.42,58.66 | v23.97,50.24 23.9,50.17 23.9,49.5 | 23.9,49.5 IC201.39 | 28.42,59.41 28.18,58.74 v28.42,58.66 | 28.42,59.41 28.65,58.74 v28.42,58.66 | 23.9,49.5 24.2,50.14 v23.97,50.24 | 23.9,49.5 23.73,50.19 v23.97,50.24
EN_INV_2
  Bottom 0.305: IC201.19 22.4,58.17 20.4,60.17 20.4,63.42 21.11,64.13 31.35,64.13 32.94,62.55 32.94,62.15 33.14,61.96 U301.6
GND  (via drill 0.5, 2.8)  (119 unrouted)
  Bottom 0.305: 15,55.01 15.24,55.01
  other vias: 16.75,57.71 11.75,53.18 20.64,51.59 16.19,53.9 11.75,49.13 7.38,55.56 24.77,59.05 29.13,62.79 30.16,58.82 23.73,63.26 26.51,57.23 35.24,58.34 10.24,60.01 10.79,62.47 31.35,50.88 22.94,55.4 33.42,65.56 42.23,64.37 34.77,63.66 33.34,55.4 29.69,56.52 26.35,48.97 25.88,46.75 30.96,45.72 29.05,46.35 33.02,45.16 36.67,45.56 38.81,44.37 33.1,48.74 36.67,48.74 36.04,52.94 20.96,43.42 22.7,42.39 26.67,43.18 15.64,32.23 7.06,32.86 22.78,22.22 18.73,28.97 22.07,32.78 26.67,29.37 34.85,41.99 36.75,37.31 22.46,37.31 41.43,38.58 46.12,32.38 41.35,45.01 41.35,52.63 44.69,56.28 30.16,66.6 22.62,66.67 22.62,68.74 30.16,68.58 30.16,70.56 28.97,71.91 22.62,70.64 23.81,71.83 12.22,69.93 8.1,69.14 20.88,68.66 43.66,71.75 46.51,16.99 45.01,19.61 31.51,16.91 28.02,21.03 20.88,18.49 17.3,16.83 8.89,16.99 16.51,59.37 18.69,47.94 15.32,44.45 15.8,41.75 28.42,35.16 33.66,29.29 23.1,61.12 18.27,69.38 39.69,63.74
GND2
  pour Bottom: 0,83.11 53.5,83.11 53.5,-0.24 0,0
  pour Top: 0,83.11 53.5,83.11 53.5,-0.24 0,0
INV_OUT
  Bottom 0.305: IC201.22 23.9,61.44 25.48,63.02 27.7,63.02 28.77,61.96 U301.3
LED  (via drill 0.5)
  Top 0.305: v18.02,57.07 18.02,56.32 | 18.02,56.32 18.02,54.77 16.91,53.66 16.91,53.34 15.87,52.31 15.87,51.67 10.08,45.88 10.08,30.95 | 10.08,30.95 10.08,30.48 v9.84,30.24 | 18.02,56.32 18.25,56.99 v18.02,57.07 | 18.02,56.32 17.78,56.99 v18.02,57.07 | 10.08,30.95 9.65,30.39 v9.84,30.24 | 10.08,30.95 10.09,30.25 v9.84,30.24
  Bottom 0.305: IC201.11 18.68,55.19 18.97,55.48 18.97,56.12 18.55,56.54 | 18.55,56.54 v18.02,57.07 | R201.2 17.44,27.65 17.07,28.02 17.07,28.97 16.03,30 10.55,30 | 10.55,30 10.08,30 v9.84,30.24 | 18.55,56.54 18.24,57.18 v18.02,57.07 | 18.55,56.54 17.91,56.85 v18.02,57.07 | 10.55,30 9.99,30.44 v9.84,30.24 | 10.55,30 9.85,29.99 v9.84,30.24
MISO  (via drill 0.5)
  Top 0.305: v35.88,42.78 35.91,42.75 35.91,42.03 | 35.91,42.03 M401.MISO 35.96,39.44 35.96,38.18 35.56,37.78 34.37,37.78 33.81,37.23 32.62,37.23 30.56,35.16 30.56,34.69 SV203.2 | 35.91,42.03 36.11,42.71 v35.88,42.78 | 35.91,42.03 35.65,42.69 v35.88,42.78
  Bottom 0.305: IC201.27 31.35,54.69 34.61,51.44 34.61,44.05 35.35,43.31 | 35.35,43.31 v35.88,42.78 | 35.35,43.31 35.65,42.68 v35.88,42.78 | 35.35,43.31 35.98,43.01 v35.88,42.78
MOSI  (via drill 0.5)
  Top 0.305: v33.89,43.66 33.91,43.64 33.91,42.91 | 33.91,42.91 M401.MOSI 33.91,38.11 33.58,37.78 32.39,37.78 31.51,36.91 30.88,36.91 30.32,36.35 SV203.1 | 33.91,42.91 34.13,43.58 v33.89,43.66 | 33.91,42.91 33.66,43.57 v33.89,43.66
  Bottom 0.305: IC201.28 31.14,54.19 34.05,51.28 34.05,44.39 | 34.05,44.39 34.05,44.21 33.89,44.05 v33.89,43.66 | 34.05,44.39 33.68,43.79 v33.89,43.66 | 34.05,44.39 34.14,43.69 v33.89,43.66
N$1
  Bottom 0.305: U301.7 35.3,61.29 35.64,60.96 35.64,60.01 35.96,59.69 D302.C
N$2
  Bottom 0.305: IC201.5 16.87,52.19 15.38,50.7 Y201.1
N$3
  Bottom 0.305: IC201.6 16.66,52.69 15.95,51.99 13.1,51.99 12.78,51.68 Y201.3
N$4  (via drill 0.5)
  Top 0.61: 38.07,31.57 39.2,32.69 C101.1 38.04,33.89 35.64,33.89 34.79,34.74 L101.2 | 38.07,31.57 v37.54,31.04 | 38.07,31.57 37.49,31.11 v37.54,31.04 | 38.07,31.57 37.62,30.98 v37.54,31.04
  Bottom 0.61: v37.54,31.04 38.07,31.57 | 38.07,31.57 38.35,31.84 IC101.3 | 38.07,31.57 37.49,31.11 v37.54,31.04 | 38.07,31.57 37.62,30.98 v37.54,31.04
N$5
  Bottom 0.305: R304.2 35.64,57.31 35.16,56.83 35.16,56.2 36.59,54.77 36.59,54.37 36.91,54.05 39.05,54.05 39.43,53.68 SJ301.2
N$6
  Bottom 0.305: LED101.A 31.59,27.72 R101.1
N$7
  Top 0.406: SV201.2 43.97,61.28 43.34,61.91 43.34,69.37 42.31,70.41 SV202.1
N$8
  Bottom 0.305: U301.5 35.21,62.59 35.88,63.26 38.1,63.26 39.37,61.99 D301.A 41.59,61.99 42.07,61.52 42.07,56.04 41.27,55.24 R301.1
N$9
  Bottom 0.305: K201.4 12.57,21.17 14.15,19.58 R205.1
N$10  (via drill 0.5)
  Top 0.305: v41.91,53.74 41.38,54.27 | 41.38,54.27 41.27,54.37 41.27,55.69 | 41.27,55.69 v41.27,56.44 | 41.38,54.27 41.69,53.63 v41.91,53.74 | 41.38,54.27 42.02,53.96 v41.91,53.74 | 41.27,55.69 41.51,56.35 v41.27,56.44 | 41.27,55.69 41.04,56.35 v41.27,56.44
  Bottom 0.305: J301.5 39.26,17.18 39.69,16.75 44.77,16.75 46.04,18.02 46.04,30.56 43.42,33.18 43.42,38.66 42.7,39.37 42.7,40.08 42.86,40.24 42.86,52.78 42.44,53.21 | D301.C 38.02,61.99 38.66,61.36 38.66,60.33 39.29,59.69 D302.A 41.2,59.69 41.51,59.37 41.51,57.86 40.96,57.31 | R304.1 40.96,57.31 | 42.44,53.21 v41.91,53.74 | v41.27,56.44 41.27,56.99 41.1,57.17 | 41.1,57.17 40.96,57.31 | 42.44,53.21 42.13,53.84 v41.91,53.74 | 42.44,53.21 41.8,53.51 v41.91,53.74 | 41.1,57.17 41.03,56.46 v41.27,56.44 | 41.1,57.17 41.48,56.57 v41.27,56.44
N$11
  Bottom 0.305: LED201.A 24.22,28.84 R201.1
N$12
  Bottom 0.305: IC201.7 14.83,53.19 C201.2
N$13
  Top 0.305: K201.3 11.67,21.96 11.67,21.51 13.6,19.58 R202.1
  Bottom 0.305: R204.1 12.96,25.42 11.67,24.13 11.67,23.76 K201.3
N$14
  Bottom 0.61: K201.1 9.22,24.46 8.41,23.65 D201.A
N$15  (via drill 0.5)
  Top 0.305: D303.A 42.41,38.68 42.89,39.16 | 42.89,39.16 v43.42,39.69 | 42.89,39.16 43.53,39.46 v43.42,39.69 | 42.89,39.16 43.2,39.79 v43.42,39.69
  Bottom 0.254: R303.2 17.16,62.67
  Bottom 0.305: 17.16,62.67 R302.2 19.2,63.73 20.16,64.69 40.4,64.69 43.42,61.67 43.42,40.44 | 43.42,40.44 v43.42,39.69 | R303.2 R305.1 | 43.42,40.44 43.18,39.77 v43.42,39.69 | 43.42,40.44 43.65,39.77 v43.42,39.69
N$16
  Top 0.61: CON401.P$3
  Top 1.016: M401.RF CON401.P$3
N$17
  Bottom 0.305: K201.2 13.33,23.66 13.81,23.18 13.81,21.99 14.18,21.61 R203.1
N$18
  Top 0.305: D303.C 42.41,30.75 41.91,30.24 40.01,30.24 39.26,29.49 J301.1
N$19
  Bottom 0.61: IC101.2 38.79,34.15 37.94,35 37.94,37.07 38.93,38.05 D101.A
N$23  (via drill 0.5)
  Top 0.305: v22.86,53.5 22.33,54.03 | 22.33,54.03 22.07,54.29 22.07,55.4 18.89,58.58 16.11,58.58 15.48,59.21 13.69,59.21 | 13.69,59.21 v12.94,59.21 | 22.33,54.03 22.64,53.39 v22.86,53.5 | 22.33,54.03 22.97,53.72 v22.86,53.5 | 13.69,59.21 13.02,59.45 v12.94,59.21 | 13.69,59.21 13.02,58.98 v12.94,59.21
  Bottom 0.305: IC201.44 21.4,52.03 22.33,52.97 | 22.33,52.97 v22.86,53.5 | 12.96,59.96 12.96,59.23 v12.94,59.21 | 12.96,59.96 R207.1 | v12.94,59.21 12.19,59.21 | 12.19,59.21 10.95,59.21 10.5,58.76 SV204.1 | 22.33,52.97 22.97,53.28 v22.86,53.5 | 22.33,52.97 22.64,53.61 v22.86,53.5 | 12.96,59.96 12.71,59.3 v12.94,59.21 | 12.96,59.96 13.17,59.29 v12.94,59.21 | 12.19,59.21 12.86,58.98 v12.94,59.21 | 12.19,59.21 12.86,59.45 v12.94,59.21
N$26
  Bottom 0.305: IC201.20 22.9,58.38 21.56,59.72 R206.1
NRF_CE  (via drill 0.5)
  Top 0.305: v27.94,51.51 27.94,50.76 | 27.94,50.76 27.94,48.42 28.57,47.78 36.67,47.78 39.91,44.55 M401.CE_2401 | 27.94,50.76 28.17,51.43 v27.94,51.51 | 27.94,50.76 27.71,51.43 v27.94,51.51
  Bottom 0.305: IC201.34 27.26,51.19 | 27.26,51.19 27.62,51.19 v27.94,51.51 | 27.26,51.19 27.97,51.27 v27.94,51.51 | 27.26,51.19 27.77,51.69 v27.94,51.51
NRF_CS  (via drill 0.5)
  Top 0.305: M401.CS_2401 27.91,42.97 25.32,45.56 25.28,45.56 | 25.28,45.56 v24.53,45.56 | 25.28,45.56 24.61,45.79 v24.53,45.56 | 25.28,45.56 24.61,45.33 v24.53,45.56
  Bottom 0.305: IC201.43 21.9,44.94 22.86,43.97 24.13,43.97 24.53,44.37 24.53,44.81 | 24.53,44.81 v24.53,45.56 | 24.53,44.81 24.76,45.48 v24.53,45.56 | 24.53,44.81 24.29,45.48 v24.53,45.56
PE1  (via drill 0.5)
  Top 0.305: v23.81,46.43 23.06,46.43 | 23.06,46.43 22.78,46.43 19.91,43.56 M401.PE1 | 23.06,46.43 23.73,46.2 v23.81,46.43 | 23.06,46.43 23.73,46.67 v23.81,46.43
  Bottom 0.305: IC201.40 23.4,47.06 | 23.4,47.06 23.4,46.85 v23.81,46.43 | 23.4,47.06 23.57,46.37 v23.81,46.43 | 23.4,47.06 23.96,46.63 v23.81,46.43
PE2  (via drill 0.5)
  Top 0.305: v23.18,45.56 22.7,45.56 22.47,45.33 | 22.47,45.33 21.91,44.77 M401.PE2 | 22.47,45.33 23.17,45.31 v23.18,45.56 | 22.47,45.33 23.03,45.76 v23.18,45.56
  Bottom 0.305: IC201.41 22.9,46.26 | 22.9,46.26 22.9,45.84 v23.18,45.56 | 22.9,46.26 22.93,45.55 v23.18,45.56 | 22.9,46.26 23.36,45.72 v23.18,45.56
PPM  (via drill 0.5)
  Top 0.305: v24.76,53.74 24.76,54.49 | 24.76,54.49 24.76,54.93 20.79,58.9 | 20.79,58.9 20.56,59.13 v20.08,59.13 | 24.76,54.49 24.53,53.82 v24.76,53.74 | 24.76,54.49 25,53.82 v24.76,53.74 | 20.79,58.9 20.23,59.33 v20.08,59.13 | 20.79,58.9 20.09,58.89 v20.08,59.13
  Bottom 0.305: IC201.29 25.51,53.69 | 25.51,53.69 24.81,53.69 v24.76,53.74 | v20.08,59.13 20,59.13 19.51,59.62 | 19.51,59.62 19.21,59.93 R302.1 | 25.51,53.69 24.86,53.97 v24.76,53.74 | 25.51,53.69 24.83,53.5 v24.76,53.74 | 19.51,59.62 19.87,59.01 v20.08,59.13 | 19.51,59.62 20.17,59.36 v20.08,59.13
RX  (via drill 0.5)
  Top 0.305: v33.34,50.96 33.34,51.59 33.44,51.7 | 33.44,51.7 36.12,54.37 37.86,54.37 39.05,55.56 39.05,57.31 41.27,59.53 41.27,66.68 39.93,68.02 39.13,68.02 38.34,68.82 SV202.2 | 33.44,51.7 33.12,51.07 v33.34,50.96 | 33.44,51.7 33.58,51.01 v33.34,50.96
  Bottom 0.305: IC201.31 30.57,52.69 32.31,50.96 32.59,50.96 | 32.59,50.96 v33.34,50.96 | 32.59,50.96 33.26,50.73 v33.34,50.96 | 32.59,50.96 33.26,51.19 v33.34,50.96
RXS
  Bottom 0.254: IC201.13 19.4,58.87 18.41,59.85 17.38,59.85 17.14,60.09 R303.1
S1  (via drill 0.5)
  Top 0.305: 19.16,55.12 17.46,53.42 17.46,53.1 16.43,52.07 16.43,51.44 10.64,45.64 10.64,30.56 16.48,24.72 S201.1 | 19.16,55.12 19.61,55.56 v19.76,55.56 | 19.16,55.12 19.84,55.33 v19.76,55.56 | 19.16,55.12 19.56,55.7 v19.76,55.56
  Bottom 0.305: IC201.14 19.9,56.3 | 19.9,56.3 19.9,55.69 v19.76,55.56 | 19.9,56.3 19.55,55.68 v19.76,55.56 | 19.9,56.3 20.01,55.6 v19.76,55.56
S2  (via drill 0.5)
  Top 0.305: 19.89,54.77 19.61,54.77 18.02,53.18 18.02,52.86 16.99,51.83 16.99,51.2 11.19,45.4 11.19,30.8 16.19,25.8 19.76,25.8 20.88,24.69 20.88,21.67 22.91,19.63 S201.2 | 19.89,54.77 v20.64,54.77 | 19.89,54.77 20.56,54.54 v20.64,54.77 | 19.89,54.77 20.56,55 v20.64,54.77
  Bottom 0.305: IC201.15 20.4,56.2 20.4,56.12 20.64,55.88 20.64,55.52 | 20.64,55.52 v20.64,54.77 | 20.64,55.52 20.4,54.85 v20.64,54.77 | 20.64,55.52 20.87,54.85 v20.64,54.77
S4  (via drill 0.5)
  Top 0.305: 19.26,53.63 18.57,52.94 18.57,52.63 17.54,51.59 17.54,50.96 11.75,45.16 11.75,31.04 16.43,26.35 20,26.35 21.43,24.92 21.43,22.62 | 19.26,53.63 19.61,53.97 v19.92,53.97 | 21.43,22.62 21.43,22.15 v21.67,21.91 | 19.26,53.63 19.96,53.73 v19.92,53.97 | 19.26,53.63 19.74,54.14 v19.92,53.97 | 21.43,22.62 21.42,21.91 v21.67,21.91 | 21.43,22.62 21.87,22.06 v21.67,21.91
  Bottom 0.305: IC201.16 20.9,56.34 21.19,56.04 21.19,55.32 21.43,55.09 21.43,54.53 20.88,53.97 20.67,53.97 | 20.67,53.97 v19.92,53.97 | v21.67,21.91 21.67,21.16 | 21.67,21.16 21.67,20.88 20.43,19.63 S201.4 | 20.67,53.97 20,54.21 v19.92,53.97 | 20.67,53.97 20,53.74 v19.92,53.97 | 21.67,21.16 21.9,21.83 v21.67,21.91 | 21.67,21.16 21.44,21.83 v21.67,21.91
S8  (via drill 0.5)
  Top 0.305: 19.97,53.18 19.61,53.18 19.13,52.71 19.13,52.39 18.1,51.36 18.1,50.72 12.3,44.93 12.3,31.27 16.67,26.91 20.24,26.91 22.43,24.72 S201.8 | 19.97,53.18 v20.72,53.18 | 19.97,53.18 20.64,52.95 v20.72,53.18 | 19.97,53.18 20.64,53.41 v20.72,53.18
  Bottom 0.305: v20.72,53.18 20.88,53.18 21.32,53.63 | 21.32,53.63 21.99,54.29 21.99,55.32 21.75,55.56 21.75,56.2 21.4,56.55 IC201.17 | 21.32,53.63 20.64,53.42 v20.72,53.18 | 21.32,53.63 20.92,53.04 v20.72,53.18
SCK  (via drill 0.5)
  Top 0.305: 34.9,46.12 32.39,46.12 31.91,45.64 M401.SCK 31.91,38.1 31.27,37.47 28.26,37.47 SV203.3 | 34.9,46.12 35,46.12 v35.48,45.64 | 34.9,46.12 35.27,45.51 v35.48,45.64 | 34.9,46.12 35.57,45.87 v35.48,45.64
  Bottom 0.305: IC201.26 31.56,55.19 35.16,51.59 35.16,46.32 | 35.16,46.32 35.16,45.96 v35.48,45.64 | 35.16,46.32 35.23,45.62 v35.48,45.64 | 35.16,46.32 35.66,45.81 v35.48,45.64
SPI_CS
  Bottom 0.305: IC201.38 24.4,46.88 25.24,46.04 25.24,37.94 25.88,37.31 25.88,35.08 SV203.4
TX  (via drill 0.5)
  Top 0.305: v32.54,51.75 32.7,51.75 33.15,52.2 | 33.15,52.2 35.88,54.93 37.62,54.93 38.5,55.8 38.5,57.55 40.72,59.77 40.72,66.44 39.69,67.47 36.51,67.47 35.8,68.18 SV202.3 | 33.15,52.2 32.47,51.99 v32.54,51.75 | 33.15,52.2 32.75,51.61 v32.54,51.75
  Bottom 0.305: IC201.30 31.1,53.19 32.01,52.28 | 32.01,52.28 v32.54,51.75 | 32.01,52.28 32.32,51.65 v32.54,51.75 | 32.01,52.28 32.65,51.98 v32.54,51.75
TXS  (via drill 0.5)
  Top 0.305: v23.1,59.93 23.85,59.93 | 23.85,59.93 28.46,59.93 | 28.46,59.93 v29.21,59.93 | 23.85,59.93 23.18,60.16 v23.1,59.93 | 23.85,59.93 23.18,59.69 v23.1,59.93 | 28.46,59.93 29.13,59.69 v29.21,59.93 | 28.46,59.93 29.13,60.16 v29.21,59.93
  Bottom 0.305: U301.1 29.54,60.66 29.5,60.62 | 29.5,60.62 29.21,60.33 v29.21,59.93 | v29.21,59.93 29.21,59.18 | 29.21,59.18 29.21,58.18 30.24,57.15 31.99,57.15 32.86,56.28 34.37,56.28 36.04,54.61 36.04,54.21 36.75,53.5 37.04,53.5 SJ301.1 | IC201.21 23.4,59.24 | 23.4,59.24 23.4,59.63 v23.1,59.93 | 23.4,59.24 23.35,59.95 v23.1,59.93 | 23.4,59.24 22.92,59.76 v23.1,59.93 | 29.5,60.62 29.03,60.09 v29.21,59.93 | 29.5,60.62 29.46,59.91 v29.21,59.93 | 29.21,59.18 29.44,59.85 v29.21,59.93 | 29.21,59.18 28.98,59.85 v29.21,59.93
USBDM  (via drill 0.5)
  Top 0.305: v22.23,51.51 21.69,50.98 | 21.69,50.98 21.51,50.8 19.76,50.8 13.95,44.98 | 13.95,44.98 13.65,44.69 v13.65,44.29 | 21.69,50.98 22.33,51.29 v22.23,51.51 | 21.69,50.98 22,51.62 v22.23,51.51 | 13.95,44.98 13.47,44.46 v13.65,44.29 | 13.95,44.98 13.9,44.28 v13.65,44.29
  Bottom 0.305: IC201.32 22.9,52.19 22.76,52.04 | 22.76,52.04 v22.23,51.51 | v13.65,44.29 13.73,44.21 14.05,44.21 14.32,43.94 | 14.32,43.94 14.53,43.74 14.53,42.86 14.05,42.39 11.11,42.39 10.64,41.91 10.64,33.26 9.52,32.15 8.41,32.15 7.94,31.67 7.94,30.88 9.37,29.45 15.8,29.45 16.51,28.73 16.51,23.81 16.01,23.31 R203.2 | 22.76,52.04 22.12,51.74 v22.23,51.51 | 22.76,52.04 22.45,51.41 v22.23,51.51 | 14.32,43.94 13.83,44.46 v13.65,44.29 | 14.32,43.94 13.62,44.05 v13.65,44.29
USBDP  (via drill 0.5)
  Top 0.305: v22.15,50.24 21.4,50.24 | 21.4,50.24 20,50.24 14.45,44.69 14.45,43.97 14.18,43.71 | 14.18,43.71 v13.65,43.18 | 21.4,50.24 22.06,50.01 v22.15,50.24 | 21.4,50.24 22.06,50.48 v22.15,50.24 | 14.18,43.71 13.55,43.4 v13.65,43.18 | 14.18,43.71 13.88,43.07 v13.65,43.18
  Bottom 0.305: IC201.33 23.59,51.69 22.68,50.77 | 22.68,50.77 v22.15,50.24 | v13.65,43.18 13.41,42.94 12.94,42.94 | 12.94,42.94 10.87,42.94 10.08,42.15 10.08,33.5 9.29,32.7 8.18,32.7 7.38,31.91 7.38,30.64 9.13,28.89 14.84,28.89 15.24,28.5 R204.2 | 22.68,50.77 22.04,50.47 v22.15,50.24 | 22.68,50.77 22.37,50.14 v22.15,50.24 | 12.94,42.94 13.65,42.93 v13.65,43.18 | 12.94,42.94 13.5,43.38 v13.65,43.18

### Text on the board
tPlace: ANT | Vin | TX | RX | 1-2: BOOT0 / 2-3: NC | GND | 1-2: 3V3 / 2-3: 5V | + | + | + | + | + | (CC)-BY-NC-SA 4.0 | BIND
bPlace: MISO**MOSI / CS**SCK / GND**3V3